# Altium project SingleChip-Rev2.PrjPcb (part 1 of 8)
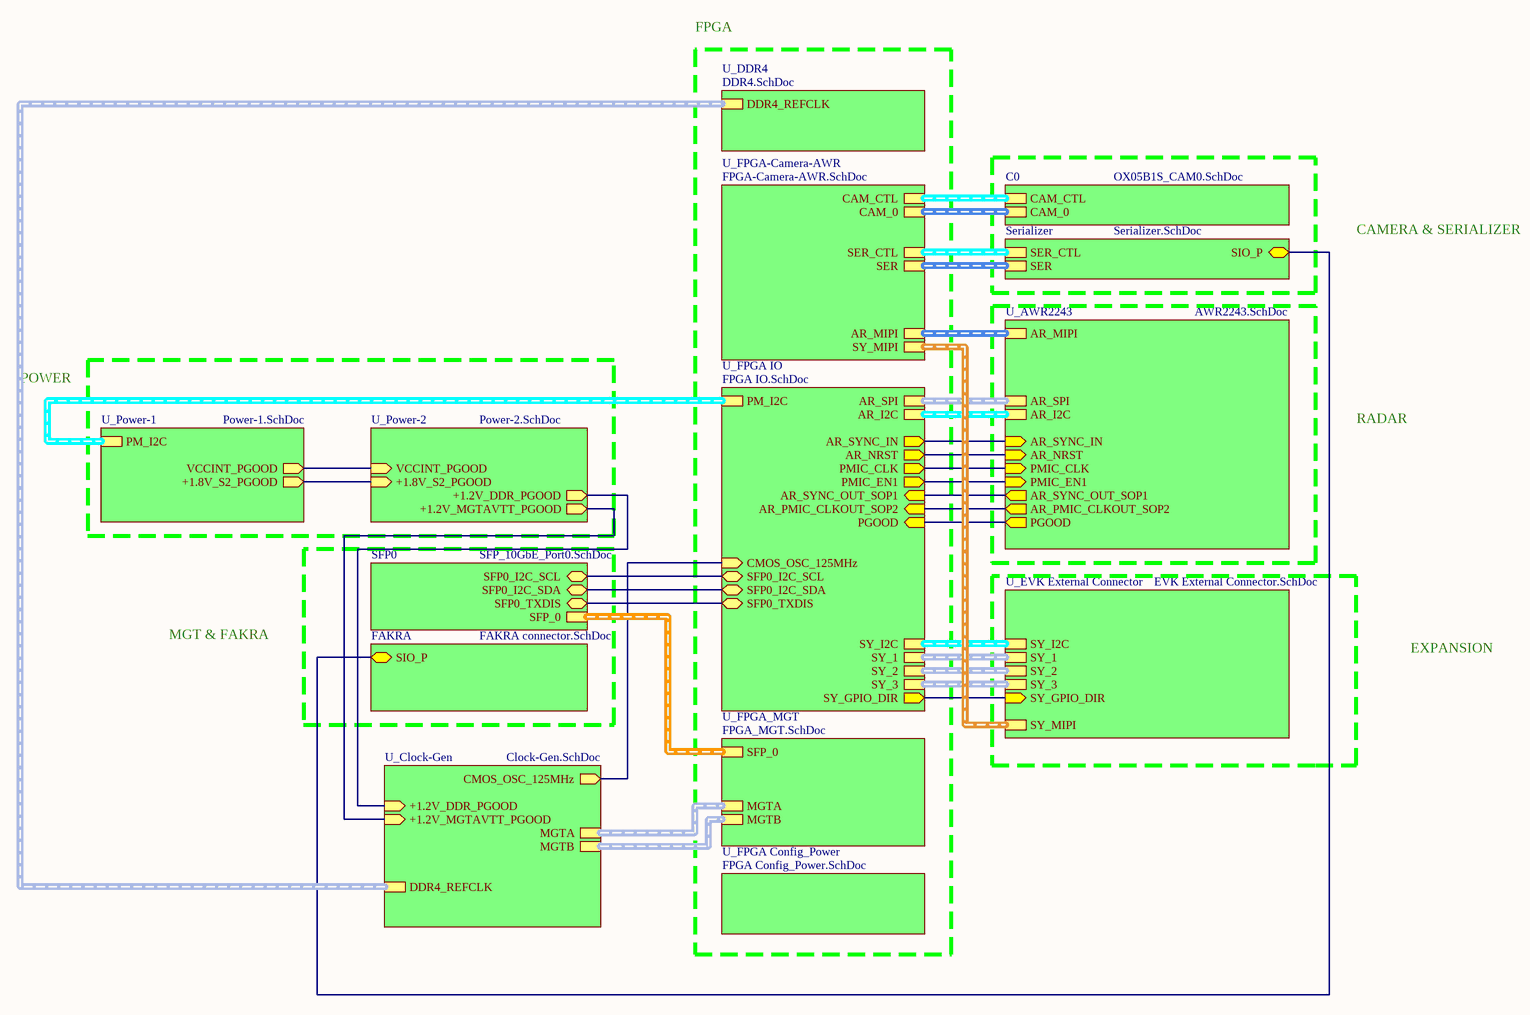
[diagram p0: SingleChipBlockDiagram.SchDoc]
docnumber: SCH-0001; ProjectTitle: Single Chip Radar (PN: BFI-2C1R); revnum: 2
20 sheets, 609 parts. Net scope: hierarchical (ports join the sheet entries above them; power ports are global).
Board file: Single Chip Radar.PcbDoc
Sheets:
  SingleChipBlockDiagram.SchDoc
    U_AWR2243 = AWR2243.SchDoc
      U_AWR2243_Decoupling_Caps = AWR2243_Decoupling_Caps.SchDoc
      U_AWR2243_DUT = AWR2243_DUT.SchDoc
      U_AWR2243_ExPWR_RST_LEDs = AWR2243_ExPWR_RST_LEDs.SchDoc
      U_AWR2243_LC_Filtering = AWR2243_LC_Filtering.SchDoc
      U_AWR2243_PMIC = AWR2243_PMIC.SchDoc
    U_DDR4 = DDR4.SchDoc
    U_FPGA-Camera-AWR = FPGA-Camera-AWR.SchDoc
    U_FPGA Config_Power = FPGA Config_Power.SchDoc
    U_FPGA IO = FPGA IO.SchDoc
    U_Power-1 = Power-1.SchDoc
    U_Power-2 = Power-2.SchDoc
    SFP0 = SFP_10GbE_Port0.SchDoc
    U_Clock-Gen = Clock-Gen.SchDoc
    C0 = OX05B1S_CAM0.SchDoc
    Serializer = Serializer.SchDoc
    U_FPGA_MGT = FPGA_MGT.SchDoc
    U_EVK External Connector = EVK External Connector.SchDoc
    FAKRA = FAKRA connector.SchDoc

## Sheet SingleChipBlockDiagram.SchDoc: =ProjectTitle
size A3; PageSetup: Record=PageOptions|CenterHorizontal=True|CenterVertical=True|PrintScale=1.00|XCorrection=1.00|YCorrection=1.00|PrintKind=0|BorderSize=5000000|LeftOffset=0|BottomOffset=0|Orientation=2|PaperLength=1000|PaperWidth=1000|Scale=100|PaperSource=15|PrintQuality=600|MediaType=1|DitherType=10|PaperKind=Letter|PrintScaleMode=1; Author: Jaime I. Chait; Organization: NWES LLC; Address1: 111 SW 5th Ave, STE 3150; Address2: Portland, OR 97204; DocumentNumber: SCH-0001; Revision: 2; SheetNumber: 1; SheetTotal: 19

### Sub-sheets
C0 = OX05B1S_CAM0.SchDoc: CAM_0 (harness MIPI), CAM_CTL (harness CAM_CTL)
FAKRA = FAKRA connector.SchDoc: SIO_P (bidir)
Serializer = Serializer.SchDoc: SER (harness MIPI), SER_CTL (harness SER_CTRL), SIO_P (bidir)
SFP0 = SFP_10GbE_Port0.SchDoc: SFP_0 (harness SFT_MGT), SFP0_I2C_SCL (bidir), SFP0_I2C_SDA (bidir), SFP0_TXDIS (bidir)
U_AWR2243 = AWR2243.SchDoc: PMIC_CLK (in), PMIC_EN1 (in), AR_SYNC_OUT_SOP1 (out), AR_PMIC_CLKOUT_SOP2 (out), AR_SPI (harness SPI), AR_MIPI (harness AR_MIPI), PGOOD (out), AR_SYNC_IN (in), AR_NRST (in), AR_I2C (harness I2C)
U_Clock-Gen = Clock-Gen.SchDoc: CMOS_OSC_125MHz (out), +1.2V_MGTAVTT_PGOOD (in), MGTA (harness DIFF_CLK), MGTB (harness DIFF_CLK), DDR4_REFCLK (harness DIFF_CLK), +1.2V_DDR_PGOOD (in)
U_DDR4 = DDR4.SchDoc: DDR4_REFCLK (harness DIFF_CLK)
U_EVK External Connector = EVK External Connector.SchDoc: SY_MIPI (harness SY_MIPI), SY_I2C (harness I2C), SY_1 (harness GPIO group), SY_2 (harness GPIO group), SY_3 (harness GPIO group), SY_GPIO_DIR (in)
U_FPGA Config_Power = FPGA Config_Power.SchDoc: no entries
U_FPGA IO = FPGA IO.SchDoc: CMOS_OSC_125MHz (in), AR_NRST (out), PGOOD (in), PMIC_CLK (out), PMIC_EN1 (out), AR_SYNC_IN (out), AR_SPI (harness SPI), SY_I2C (harness I2C), AR_I2C (harness I2C), AR_PMIC_CLKOUT_SOP2 (in), AR_SYNC_OUT_SOP1 (in), PM_I2C (harness I2C), SFP0_I2C_SCL (bidir), SFP0_I2C_SDA (bidir), SFP0_TXDIS (bidir), SY_1 (harness GPIO group), SY_2 (harness GPIO group), SY_3 (harness GPIO group), SY_GPIO_DIR (out)
U_FPGA-Camera-AWR = FPGA-Camera-AWR.SchDoc: AR_MIPI (harness AR_MIPI), CAM_0 (harness MIPI), CAM_CTL (harness CAM_CTL), SY_MIPI (harness SY_MIPI), SER (harness MIPI), SER_CTL (harness SER_CTRL)
U_FPGA_MGT = FPGA_MGT.SchDoc: MGTA (harness DIFF_CLK), MGTB (harness DIFF_CLK), SFP_0 (harness SFT_MGT)
U_Power-1 = Power-1.SchDoc: +1.8V_S2_PGOOD (out), VCCINT_PGOOD (out), PM_I2C (harness I2C)
U_Power-2 = Power-2.SchDoc: VCCINT_PGOOD (in), +1.2V_MGTAVTT_PGOOD (out), +1.8V_S2_PGOOD (in), +1.2V_DDR_PGOOD (out)

### Nets
+1.2V_DDR_PGOOD: sheet U_Power-2/+1.2V_DDR_PGOOD, sheet U_Clock-Gen/+1.2V_DDR_PGOOD
+1.2V_MGTAVTT_PGOOD: sheet U_Power-2/+1.2V_MGTAVTT_PGOOD, sheet U_Clock-Gen/+1.2V_MGTAVTT_PGOOD
+1.8V_S2_PGOOD: sheet U_Power-1/+1.8V_S2_PGOOD, sheet U_Power-2/+1.8V_S2_PGOOD
AR_NRST: sheet U_AWR2243/AR_NRST, sheet U_FPGA IO/AR_NRST
AR_PMIC_CLKOUT_SOP2: sheet U_AWR2243/AR_PMIC_CLKOUT_SOP2, sheet U_FPGA IO/AR_PMIC_CLKOUT_SOP2
AR_SYNC_IN: sheet U_AWR2243/AR_SYNC_IN, sheet U_FPGA IO/AR_SYNC_IN
AR_SYNC_OUT_SOP1: sheet U_AWR2243/AR_SYNC_OUT_SOP1, sheet U_FPGA IO/AR_SYNC_OUT_SOP1
CMOS_OSC_125MHz: sheet U_FPGA IO/CMOS_OSC_125MHz, sheet U_Clock-Gen/CMOS_OSC_125MHz
PGOOD: sheet U_AWR2243/PGOOD, sheet U_FPGA IO/PGOOD
PMIC_CLK: sheet U_AWR2243/PMIC_CLK, sheet U_FPGA IO/PMIC_CLK
PMIC_EN1: sheet U_AWR2243/PMIC_EN1, sheet U_FPGA IO/PMIC_EN1
SFP_CTRL0_I2C_SCL: sheet U_FPGA IO/SFP0_I2C_SCL, sheet SFP0/SFP0_I2C_SCL
SFP_CTRL0_I2C_SDA: sheet U_FPGA IO/SFP0_I2C_SDA, sheet SFP0/SFP0_I2C_SDA
SFP_CTRL0_TX_DISABLE: sheet U_FPGA IO/SFP0_TXDIS, sheet SFP0/SFP0_TXDIS
SY_GPIO_DIR: sheet U_FPGA IO/SY_GPIO_DIR, sheet U_EVK External Connector/SY_GPIO_DIR
VCCINT_PGOOD: sheet U_Power-1/VCCINT_PGOOD, sheet U_Power-2/VCCINT_PGOOD
NetC188_1: sheet Serializer/SIO_P, sheet FAKRA/SIO_P

### Buses and harness runs
harness sheet C0/CAM_0 = sheet U_FPGA-Camera-AWR/CAM_0
harness sheet C0/CAM_CTL = sheet U_FPGA-Camera-AWR/CAM_CTL
harness sheet Serializer/SER = sheet U_FPGA-Camera-AWR/SER
harness sheet Serializer/SER_CTL = sheet U_FPGA-Camera-AWR/SER_CTL
harness sheet SFP0/SFP_0 = sheet U_FPGA_MGT/SFP_0
harness sheet U_AWR2243/AR_I2C = sheet U_FPGA IO/AR_I2C
harness sheet U_AWR2243/AR_MIPI = sheet U_FPGA-Camera-AWR/AR_MIPI
harness sheet U_AWR2243/AR_SPI = sheet U_FPGA IO/AR_SPI
harness sheet U_Clock-Gen/DDR4_REFCLK = sheet U_DDR4/DDR4_REFCLK
harness sheet U_Clock-Gen/MGTA = sheet U_FPGA_MGT/MGTA
harness sheet U_Clock-Gen/MGTB = sheet U_FPGA_MGT/MGTB
harness sheet U_EVK External Connector/SY_1 = sheet U_FPGA IO/SY_1
harness sheet U_EVK External Connector/SY_2 = sheet U_FPGA IO/SY_2
harness sheet U_EVK External Connector/SY_3 = sheet U_FPGA IO/SY_3
harness sheet U_EVK External Connector/SY_I2C = sheet U_FPGA IO/SY_I2C
harness sheet U_EVK External Connector/SY_MIPI = sheet U_FPGA-Camera-AWR/SY_MIPI
harness sheet U_FPGA IO/PM_I2C = sheet U_Power-1/PM_I2C

### Notes on the sheet
- FPGA
- CAMERA & SERIALIZER
- POWER
- RADAR
- MGT & FAKRA
- EXPANSION
- Title
- Size:
- Date:
- A4
- Number:
- Time:
- Revision:
- Sheet
- of
- File:

## Sheet AWR2243.SchDoc: =ProjectTitle
size A3; PageSetup: Record=PageOptions|CenterHorizontal=True|CenterVertical=True|PrintScale=1.00|XCorrection=1.00|YCorrection=1.00|PrintKind=0|BorderSize=5000000|LeftOffset=0|BottomOffset=0|Orientation=2|PaperLength=1000|PaperWidth=1000|Scale=100|PaperSource=15|PrintQuality=600|MediaType=1|DitherType=10|PaperKind=Letter|PrintScaleMode=1; Author: Jaime I. Chait; Organization: NWES LLC; Address1: 111 SW 5th Ave, STE 3150; Address2: Portland, OR 97204; DocumentNumber: SCH-0001; Revision: 2; SheetNumber: 4; SheetTotal: 19
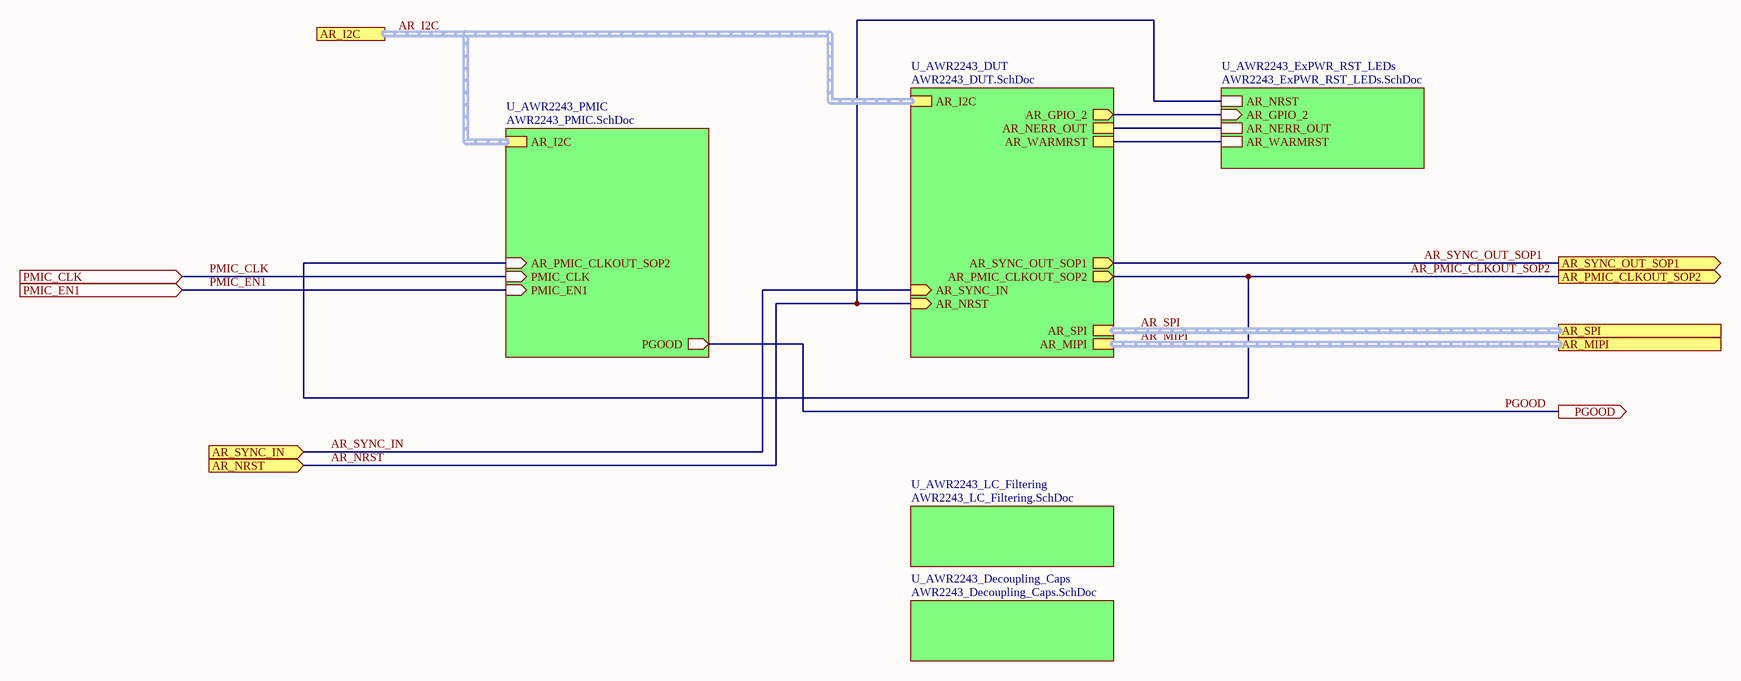
[diagram p1: AWR2243.SchDoc]

### Sub-sheets
U_AWR2243_Decoupling_Caps = AWR2243_Decoupling_Caps.SchDoc: no entries
U_AWR2243_DUT = AWR2243_DUT.SchDoc: AR_SYNC_IN (in), AR_MIPI (harness AR_MIPI), AR_SPI (harness SPI), AR_GPIO_2 (out), AR_PMIC_CLKOUT_SOP2 (out), AR_NRST (in), AR_SYNC_OUT_SOP1 (out), AR_NERR_OUT, AR_WARMRST, AR_I2C (harness I2C)
U_AWR2243_ExPWR_RST_LEDs = AWR2243_ExPWR_RST_LEDs.SchDoc: AR_NRST, AR_GPIO_2 (in), AR_NERR_OUT, AR_WARMRST
U_AWR2243_LC_Filtering = AWR2243_LC_Filtering.SchDoc: no entries
U_AWR2243_PMIC = AWR2243_PMIC.SchDoc: PMIC_CLK (in), PMIC_EN1 (in), PGOOD (out), AR_PMIC_CLKOUT_SOP2 (in), AR_I2C (harness I2C)

### Ports
AR_I2C (harness I2C), AR_MIPI (harness AR_MIPI), AR_NRST (in), AR_PMIC_CLKOUT_SOP2 (out), AR_SPI (harness SPI), AR_SYNC_IN (in), AR_SYNC_OUT_SOP1 (out), PGOOD (out), PMIC_CLK (in), PMIC_EN1 (in)

### Nets
AR_GPIO_2: sheet U_AWR2243_DUT/AR_GPIO_2, sheet U_AWR2243_ExPWR_RST_LEDs/AR_GPIO_2
AR_NERR_OUT: sheet U_AWR2243_DUT/AR_NERR_OUT, sheet U_AWR2243_ExPWR_RST_LEDs/AR_NERR_OUT
AR_NRST: port AR_NRST, sheet U_AWR2243_DUT/AR_NRST, sheet U_AWR2243_ExPWR_RST_LEDs/AR_NRST
AR_PMIC_CLKOUT_SOP2: port AR_PMIC_CLKOUT_SOP2, sheet U_AWR2243_DUT/AR_PMIC_CLKOUT_SOP2, sheet U_AWR2243_PMIC/AR_PMIC_CLKOUT_SOP2
AR_SYNC_IN: port AR_SYNC_IN, sheet U_AWR2243_DUT/AR_SYNC_IN
AR_SYNC_OUT_SOP1: port AR_SYNC_OUT_SOP1, sheet U_AWR2243_DUT/AR_SYNC_OUT_SOP1
AR_WARMRST: sheet U_AWR2243_DUT/AR_WARMRST, sheet U_AWR2243_ExPWR_RST_LEDs/AR_WARMRST
PGOOD: port PGOOD, sheet U_AWR2243_PMIC/PGOOD
PMIC_CLK: port PMIC_CLK, sheet U_AWR2243_PMIC/PMIC_CLK
PMIC_EN1: port PMIC_EN1, sheet U_AWR2243_PMIC/PMIC_EN1

### Buses and harness runs
harness AR_I2C = port AR_I2C = sheet U_AWR2243_DUT/AR_I2C = sheet U_AWR2243_PMIC/AR_I2C
harness AR_MIPI = port AR_MIPI = sheet U_AWR2243_DUT/AR_MIPI
harness AR_SPI = port AR_SPI = sheet U_AWR2243_DUT/AR_SPI

### Notes on the sheet
- Title
- Size:
- Date:
- A4
- Number:
- Time:
- Revision:
- Sheet
- of
- File:

## Sheet AWR2243_Decoupling_Caps.SchDoc: =ProjectTitle
size A3; PageSetup: Record=PageOptions|CenterHorizontal=True|CenterVertical=True|PrintScale=1.00|XCorrection=1.00|YCorrection=1.00|PrintKind=0|BorderSize=5000000|LeftOffset=0|BottomOffset=0|Orientation=2|PaperLength=1000|PaperWidth=1000|Scale=100|PaperSource=15|PrintQuality=600|MediaType=1|DitherType=10|PaperKind=Letter|PrintScaleMode=1; Author: Jaime I. Chait; Organization: NWES LLC; Address1: 111 SW 5th Ave, STE 3150; Address2: Portland, OR 97204; DocumentNumber: SCH-0001; Revision: 2; SheetNumber: 5; SheetTotal: 19
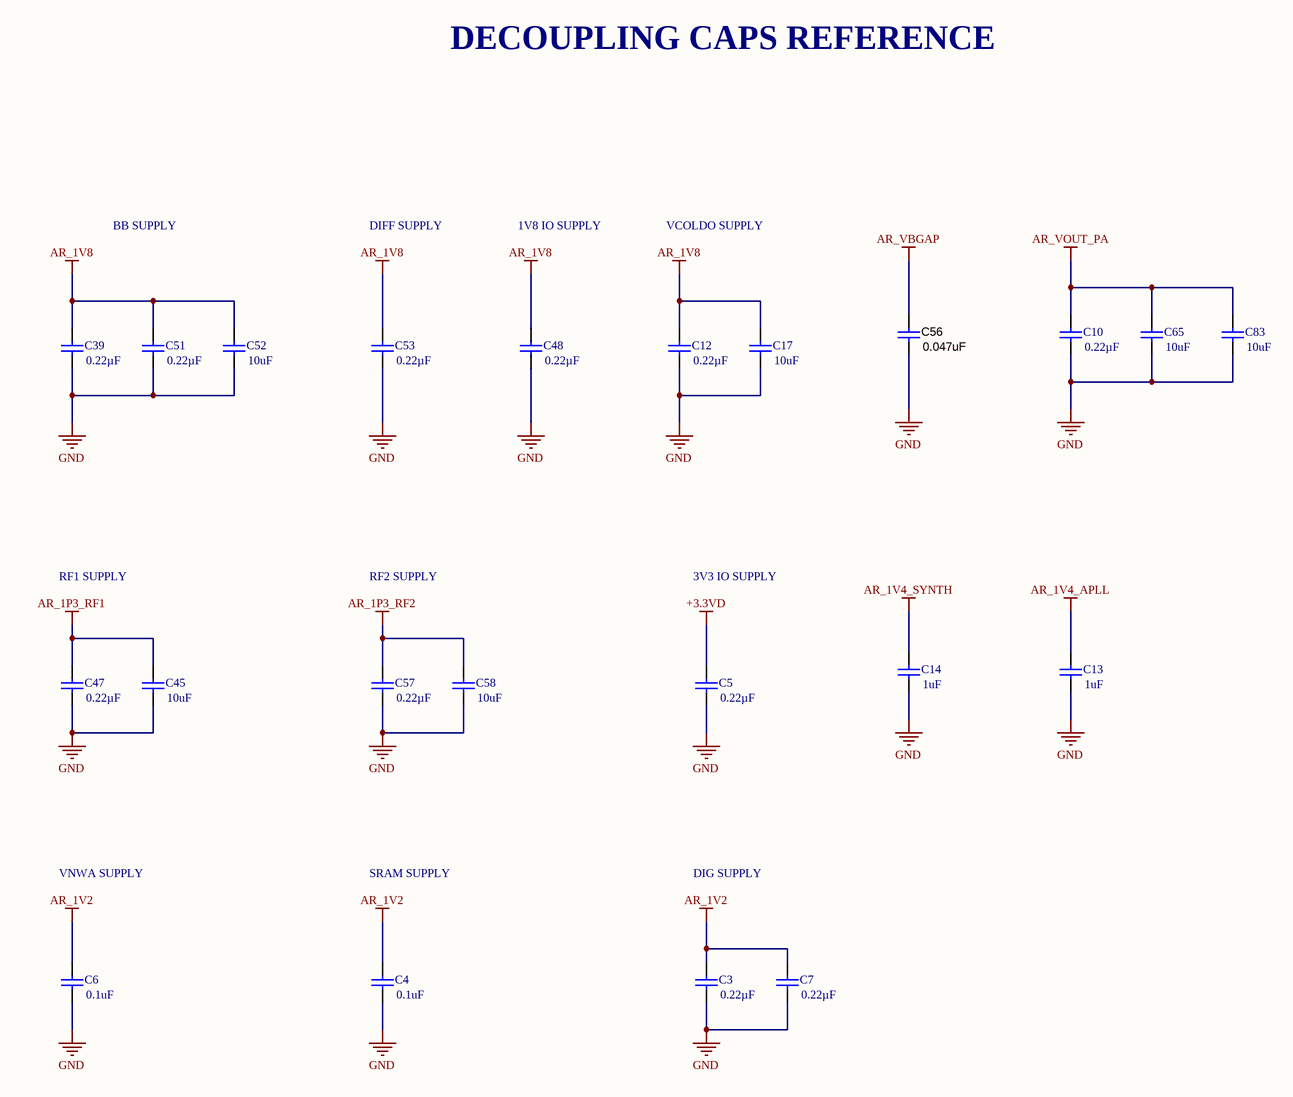
[diagram p2: AWR2243_Decoupling_Caps.SchDoc]

### Parts
C3  ValueDisplayed: 0.22µF  [0402L]  (hidden comment: GCM155R71C224KE02D)
C4  ValueDisplayed: 0.1uF  [0402L]  (hidden comment: GCM155R71C104KA55D)
C5  ValueDisplayed: 0.22µF  [0402L]  (hidden comment: GCM155R71C224KE02D)
C6  ValueDisplayed: 0.1uF  [0402]  (hidden comment: GCM155R71C104KA55D)
C7  ValueDisplayed: 0.22µF  [0402L]  (hidden comment: GCM155R71C224KE02D)
C10  ValueDisplayed: 0.22µF  [0402]  (hidden comment: GCM155R71C224KE02D)
C12  ValueDisplayed: 0.22µF  [0402]  (hidden comment: GCM155R71C224KE02D)
C13  ValueDisplayed: 1uF  [0603]  (hidden comment: GCM188R71C105KA64D)
C14  ValueDisplayed: 1uF  [0603]  (hidden comment: GCM188R71C105KA64D)
C17  ValueDisplayed: 10uF  [0805_HV]  (hidden comment: GCM21BR71A106KE22L)
C39  ValueDisplayed: 0.22µF  [0402L]  (hidden comment: GCM155R71C224KE02D)
C45  ValueDisplayed: 10uF  [0805_HV1]  (hidden comment: GCM21BR71A106KE22L)
C47  ValueDisplayed: 0.22µF  [0402L]  (hidden comment: GCM155R71C224KE02D)
C48  ValueDisplayed: 0.22µF  [0402]  (hidden comment: GCM155R71C224KE02D)
C51  ValueDisplayed: 0.22µF  [0402]  (hidden comment: GCM155R71C224KE02D)
C52  ValueDisplayed: 10uF  [0805_HV]  (hidden comment: GCM21BR71A106KE22L)
C53  ValueDisplayed: 0.22µF  [0402]  (hidden comment: GCM155R71C224KE02D)
C56  ValueDisplayed: 0.047uF  [0402]  (hidden comment: CGA2B3X7R1H473K050BB)
C57  ValueDisplayed: 0.22µF  [0402]  (hidden comment: GCM155R71C224KE02D)
C58  ValueDisplayed: 10uF  [0805]  (hidden comment: GCM21BR71A106KE22L)
C65  ValueDisplayed: 10uF  [0805_HV]  (hidden comment: GCM21BR71A106KE22L)
C83  ValueDisplayed: 10uF  [0805_HV]  (hidden comment: GCM21BR71A106KE22L)

### Nets
+3.3VD: C5.1
AR_1P3_RF1: C45.1 C47.1
AR_1P3_RF2: C57.1 C58.1
AR_1V2: C3.1 C4.1 C6.1 C7.1
AR_1V4_APLL: C13.1
AR_1V4_SYNTH: C14.1
AR_1V8: C12.1 C17.1 C39.1 C48.1 C51.1 C52.1 C53.1
AR_VBGAP: C56.1
AR_VOUT_PA: C10.1 C65.1 C83.1
GND: C3.2 C4.2 C5.2 C6.2 C7.2 C10.2 C12.2 C13.2 C14.2 C17.2 C39.2 C45.2 C47.2 C48.2 C51.2 C52.2 C53.2 C56.2 C57.2 C58.2 C65.2 C83.2

### Notes on the sheet
- DECOUPLING CAPS REFERENCE
- BB SUPPLY
- DIFF SUPPLY
- 1V8 IO SUPPLY
- VCOLDO SUPPLY
- RF1 SUPPLY
- RF2 SUPPLY
- 3V3 IO SUPPLY
- VNWA SUPPLY
- SRAM SUPPLY
- DIG SUPPLY
- Title
- Size:
- Date:
- A4
- Number:
- Time:
- Revision:
- Sheet
- of
- File:

### Library data of the parts
C3 C5 C7 C39 C47 = CMP-0078265-1: CAP, CERM, 0.22 µF, 16 V,+/- 10%, X7R, AEC-Q200 Grade 1, 0402; Manufacturer: MuRata; TaMin_C: -55°C; Polarized: N; SizeAreaWB_mm2: 3; U/M: EA; Value: 0.22uF; TaMax_C: 125°C; SizeZ_mm: 0.6; SizeX_mm: 1; SizeY_mm: 0.5; Cap_Case: 0402; Value2: 16V; CompType: Capacitor; AEC Qualified: Y; Cap_F: 220nF; AEC Category: Q200; ComponentLink1URL: http://psearch.en.murata.com/capacitor/product/GCM155R71C224KE02%23.pdf; Supplier Part Number 2: 81-GCM155R71C224KE2D; Supplier 2: Mouser; TempCo: X7R; RoHS: Y; MountType: SMT; Supplier 1: Digi-Key; PackageReference: 0402; Tolerance_%: 10%; SizeArea_mm2: 0.5; PartNumber: GCM155R71C224KE02D; VDC_V: 16V; ComponentLink1Description: Datasheet link; AEC Grade: 1; Supplier Part Number 1: 490-10671-1-ND; Technology: Ceramic
C4 = CMP-0006351-2: CAP, CERM, 0.1 uF, 16 V, +/- 10%, X7R, 0402; Manufacturer: MuRata; TaMin_C: -55°C; Polarized: N; SizeAreaWB_mm2: 3; Value1: Unknown; U/M: EA; Value: 0.1uF; TaMax_C: 125°C; SizeZ_mm: 0.6; SizeX_mm: 1; SizeY_mm: 0.5; Cap_Case: 0402; Value2: 16V; CompType: Capacitor; Cap_F: 100nF; AEC Category: Q200; Publisher: Texas Instruments; TempCo: X7R; Published: 2008-06-19; RoHS: Y; MountType: SMT; Supplier 1: Digi-Key; PackageReference: 0402; Tolerance_%: 10%; SizeArea_mm2: 0.5; LatestRevisionDate: 2017-03-09; PartNumber: GCM155R71C104KA55D; AEC Qualified: ?; VDC_V: 16V; ComponentLink1Description: Datasheet link; Supplier Part Number 1: 490-4759-2-ND; Technology: Ceramic; ComponentLink1URL: http://psearch.murata.com/capacitor/product/GCM155R71C104KA55%23.pdf
C6 = CMP-0006351-2: CAP, CERM, 0.1 uF, 16 V, +/- 10%, X7R, 0402; Manufacturer: MuRata; TaMin_C: -55°C; Polarized: N; SizeAreaWB_mm2: 3; Value1: Unknown; U/M: EA; Value: 0.1uF; TaMax_C: 125°C; SizeZ_mm: 0.6; SizeX_mm: 1; SizeY_mm: 0.5; Value2: 16V; Cap_F: 100nF; AEC Category: Q200; Publisher: Texas Instruments; TempCo: X7R; Published: 2008-06-19; RoHS: Y; MountType: SMT; Supplier 1: Digi-Key; PackageReference: 0402; Tolerance_%: 10%; Cap_Case: 0402; SizeArea_mm2: 0.5; CompType: Capacitor; LatestRevisionDate: 2017-03-09; PartNumber: GCM155R71C104KA55D; AEC Qualified: ?; VDC_V: 16V; ComponentLink1Description: Datasheet link; Supplier Part Number 1: 490-4759-2-ND; Technology: Ceramic; ComponentLink1URL: http://psearch.murata.com/capacitor/product/GCM155R71C104KA55%23.pdf
C10 C12 C48 C51 C53 C57 = CMP-0078265-1: CAP, CERM, 0.22 µF, 16 V,+/- 10%, X7R, AEC-Q200 Grade 1, 0402; Manufacturer: MuRata; TaMin_C: -55°C; Polarized: N; SizeAreaWB_mm2: 3; U/M: EA; Value: 0.22uF; TaMax_C: 125°C; SizeZ_mm: 0.6; SizeX_mm: 1; SizeY_mm: 0.5; Value2: 16V; AEC Qualified: Y; Cap_F: 220nF; AEC Category: Q200; ComponentLink1URL: http://psearch.en.murata.com/capacitor/product/GCM155R71C224KE02%23.pdf; Supplier Part Number 2: 81-GCM155R71C224KE2D; Supplier 2: Mouser; TempCo: X7R; RoHS: Y; MountType: SMT; Supplier 1: Digi-Key; PackageReference: 0402; Tolerance_%: 10%; Cap_Case: 0402; SizeArea_mm2: 0.5; CompType: Capacitor; PartNumber: GCM155R71C224KE02D; VDC_V: 16V; ComponentLink1Description: Datasheet link; AEC Grade: 1; Supplier Part Number 1: 490-10671-1-ND; Technology: Ceramic
C13 C14 = CMP-0007136-5: CAP, CERM, 1 uF, 16 V, +/- 10%, X7R, AEC-Q200 Grade 1, 0603; Manufacturer: MuRata; TaMin_C: -55°C; Polarized: N; SizeAreaWB_mm2: 4.68; Value1: Unknown; U/M: EA; Value: 1uF; TaMax_C: 125°C; SizeZ_mm: 1; SizeX_mm: 1.6; SizeY_mm: 0.8; Value2: 16V; SizeArea_mm2: 1.28; AEC Qualified: Y; Cap_F: 1µF; AEC Category: Q200; Supplier Part Number 2: 81-GCM188R71C105K64D; Publisher: Texas Instruments; Supplier 2: Mouser; TempCo: X7R; Published: 2008-06-19; RoHS: Y; MountType: SMT; Supplier 1: Digi-Key; PackageReference: 0603; Tolerance_%: 10%; Cap_Case: 0603; CompType: Capacitor; LatestRevisionDate: 2017-03-09; PartNumber: GCM188R71C105KA64D; VDC_V: 16V; ComponentLink1Description: Datasheet link; AEC Grade: 1; Supplier Part Number 1: 490-5241-6-ND; Technology: Ceramic; ComponentLink1URL: http://psearch.en.murata.com/capacitor/product/GCM188R71C105KA64%23.pdf
C17 C52 C65 C83 = CMP-0008017-2: CAP, CERM, 10 uF, 10 V, +/- 10%, X7R, 0805; Manufacturer: MuRata; TaMin_C: -55°C; Polarized: N; SizeAreaWB_mm2: 6.75; Value1: Unknown; U/M: EA; Value: 10uF; TaMax_C: 125°C; SizeZ_mm: 1.45; SizeX_mm: 2; SizeY_mm: 1.25; Cap_Case: 0805; Value2: 10V; SizeArea_mm2: 2.5; Cap_F: 10µF; AEC Category: Q200; Supplier Part Number 2: 06AC6014; Publisher: Texas Instruments; Supplier 2: Newark; Supplier Part Number 3: 81-GCM21BR71A106KE2L; TempCo: X7R; Supplier 3: Mouser; Published: 2008-06-19; RoHS: Y; MountType: SMT; Supplier 1: Digi-Key; PackageReference: 0805; Tolerance_%: 10%; CompType: Capacitor; LatestRevisionDate: 2017-03-09; PartNumber: GCM21BR71A106KE22L; AEC Qualified: ?; VDC_V: 10V; ComponentLink1Description: Datasheet link; Supplier Part Number 1: 490-10674-1-ND; Technology: Ceramic; ComponentLink1URL: http://www.murata.com/products/catalog/pdf/c03e.pdf
C45 = CMP-0008017-2: CAP, CERM, 10 uF, 10 V, +/- 10%, X7R, 0805; Manufacturer: MuRata; TaMin_C: -55°C; Polarized: N; SizeAreaWB_mm2: 6.75; Value1: Unknown; U/M: EA; Value: 10uF; TaMax_C: 125°C; SizeZ_mm: 1.45; SizeX_mm: 2; SizeY_mm: 1.25; Cap_Case: 0805; Value2: 10V; SizeArea_mm2: 2.5; CompType: Capacitor; Cap_F: 10µF; AEC Category: Q200; Supplier Part Number 2: 06AC6014; Publisher: Texas Instruments; Supplier 2: Newark; Supplier Part Number 3: 81-GCM21BR71A106KE2L; TempCo: X7R; Supplier 3: Mouser; Published: 2008-06-19; RoHS: Y; MountType: SMT; Supplier 1: Digi-Key; PackageReference: 0805; Tolerance_%: 10%; LatestRevisionDate: 2017-03-09; PartNumber: GCM21BR71A106KE22L; AEC Qualified: ?; VDC_V: 10V; ComponentLink1Description: Datasheet link; Supplier Part Number 1: 490-10674-1-ND; Technology: Ceramic; ComponentLink1URL: http://www.murata.com/products/catalog/pdf/c03e.pdf
C56 = CMP-0006330-2: CAP, CERM, 0.047 uF, 50 V, +/- 10%, X7R, AEC-Q200 Grade 1, 0402; Manufacturer: TDK; TaMin_C: -55°C; ESR_ohm: 0.06407; Polarized: N; SizeAreaWB_mm2: 3; Value1: 0.06407 ohm; U/M: EA; TaMax_C: 125°C; SizeZ_mm: 0.6; SizeX_mm: 1; SizeY_mm: 0.5; Value2: 50V; AEC Qualified: Y; Cap_F: 47nF; IRMS_A: 646.122mA; AEC Category: Q200; Supplier Part Number 2: 810-CGA2B3X7R1H473K050BB; Publisher: Texas Instruments; Supplier 2: Mouser; TempCo: X7R; Published: 2008-06-19; RoHS: Y; MountType: SMT; Value: 0.047uF; Supplier 1: Digi-Key; PackageReference: 0402; Tolerance_%: 10%; Cap_Case: 0402; SizeArea_mm2: 0.5; CompType: Capacitor; LatestRevisionDate: 2017-03-09; PartNumber: CGA2B3X7R1H473K050BB; VDC_V: 50V; ComponentLink1Description: Datasheet link; AEC Grade: 1; Supplier Part Number 1: 445-6897-1-ND; Technology: Ceramic; ComponentLink1URL: https://product.tdk.com/en/search/capacitor/ceramic/mlcc/info?part_no=CGA2B3X7R1H473K050BB
C58 = CMP-0008017-2: CAP, CERM, 10 uF, 10 V, +/- 10%, X7R, 0805; Manufacturer: MuRata; TaMin_C: -55°C; Polarized: N; SizeAreaWB_mm2: 6.75; Value1: Unknown; U/M: EA; Value: 10uF; TaMax_C: 125°C; SizeZ_mm: 1.45; SizeX_mm: 2; SizeY_mm: 1.25; Value2: 10V; SizeArea_mm2: 2.5; CompType: Capacitor; Cap_F: 10µF; AEC Category: Q200; Supplier Part Number 2: 06AC6014; Publisher: Texas Instruments; Supplier 2: Newark; Supplier Part Number 3: 81-GCM21BR71A106KE2L; TempCo: X7R; Supplier 3: Mouser; Published: 2008-06-19; RoHS: Y; MountType: SMT; Supplier 1: Digi-Key; PackageReference: 0805; Tolerance_%: 10%; Cap_Case: 0805; LatestRevisionDate: 2017-03-09; PartNumber: GCM21BR71A106KE22L; AEC Qualified: ?; VDC_V: 10V; ComponentLink1Description: Datasheet link; Supplier Part Number 1: 490-10674-1-ND; Technology: Ceramic; ComponentLink1URL: http://www.murata.com/products/catalog/pdf/c03e.pdf

## Sheet AWR2243_DUT.SchDoc: =ProjectTitle
size A3; PageSetup: Record=PageOptions|CenterHorizontal=True|CenterVertical=True|PrintScale=1.00|XCorrection=1.00|YCorrection=1.00|PrintKind=0|BorderSize=5000000|LeftOffset=0|BottomOffset=0|Orientation=2|PaperLength=1000|PaperWidth=1000|Scale=100|PaperSource=15|PrintQuality=600|MediaType=1|DitherType=10|PaperKind=Letter|PrintScaleMode=1; Author: Jaime I. Chait; Organization: NWES LLC; Address1: 111 SW 5th Ave, STE 3150; Address2: Portland, OR 97204; DocumentNumber: SCH-0001; Revision: 2; SheetNumber: 6; SheetTotal: 19
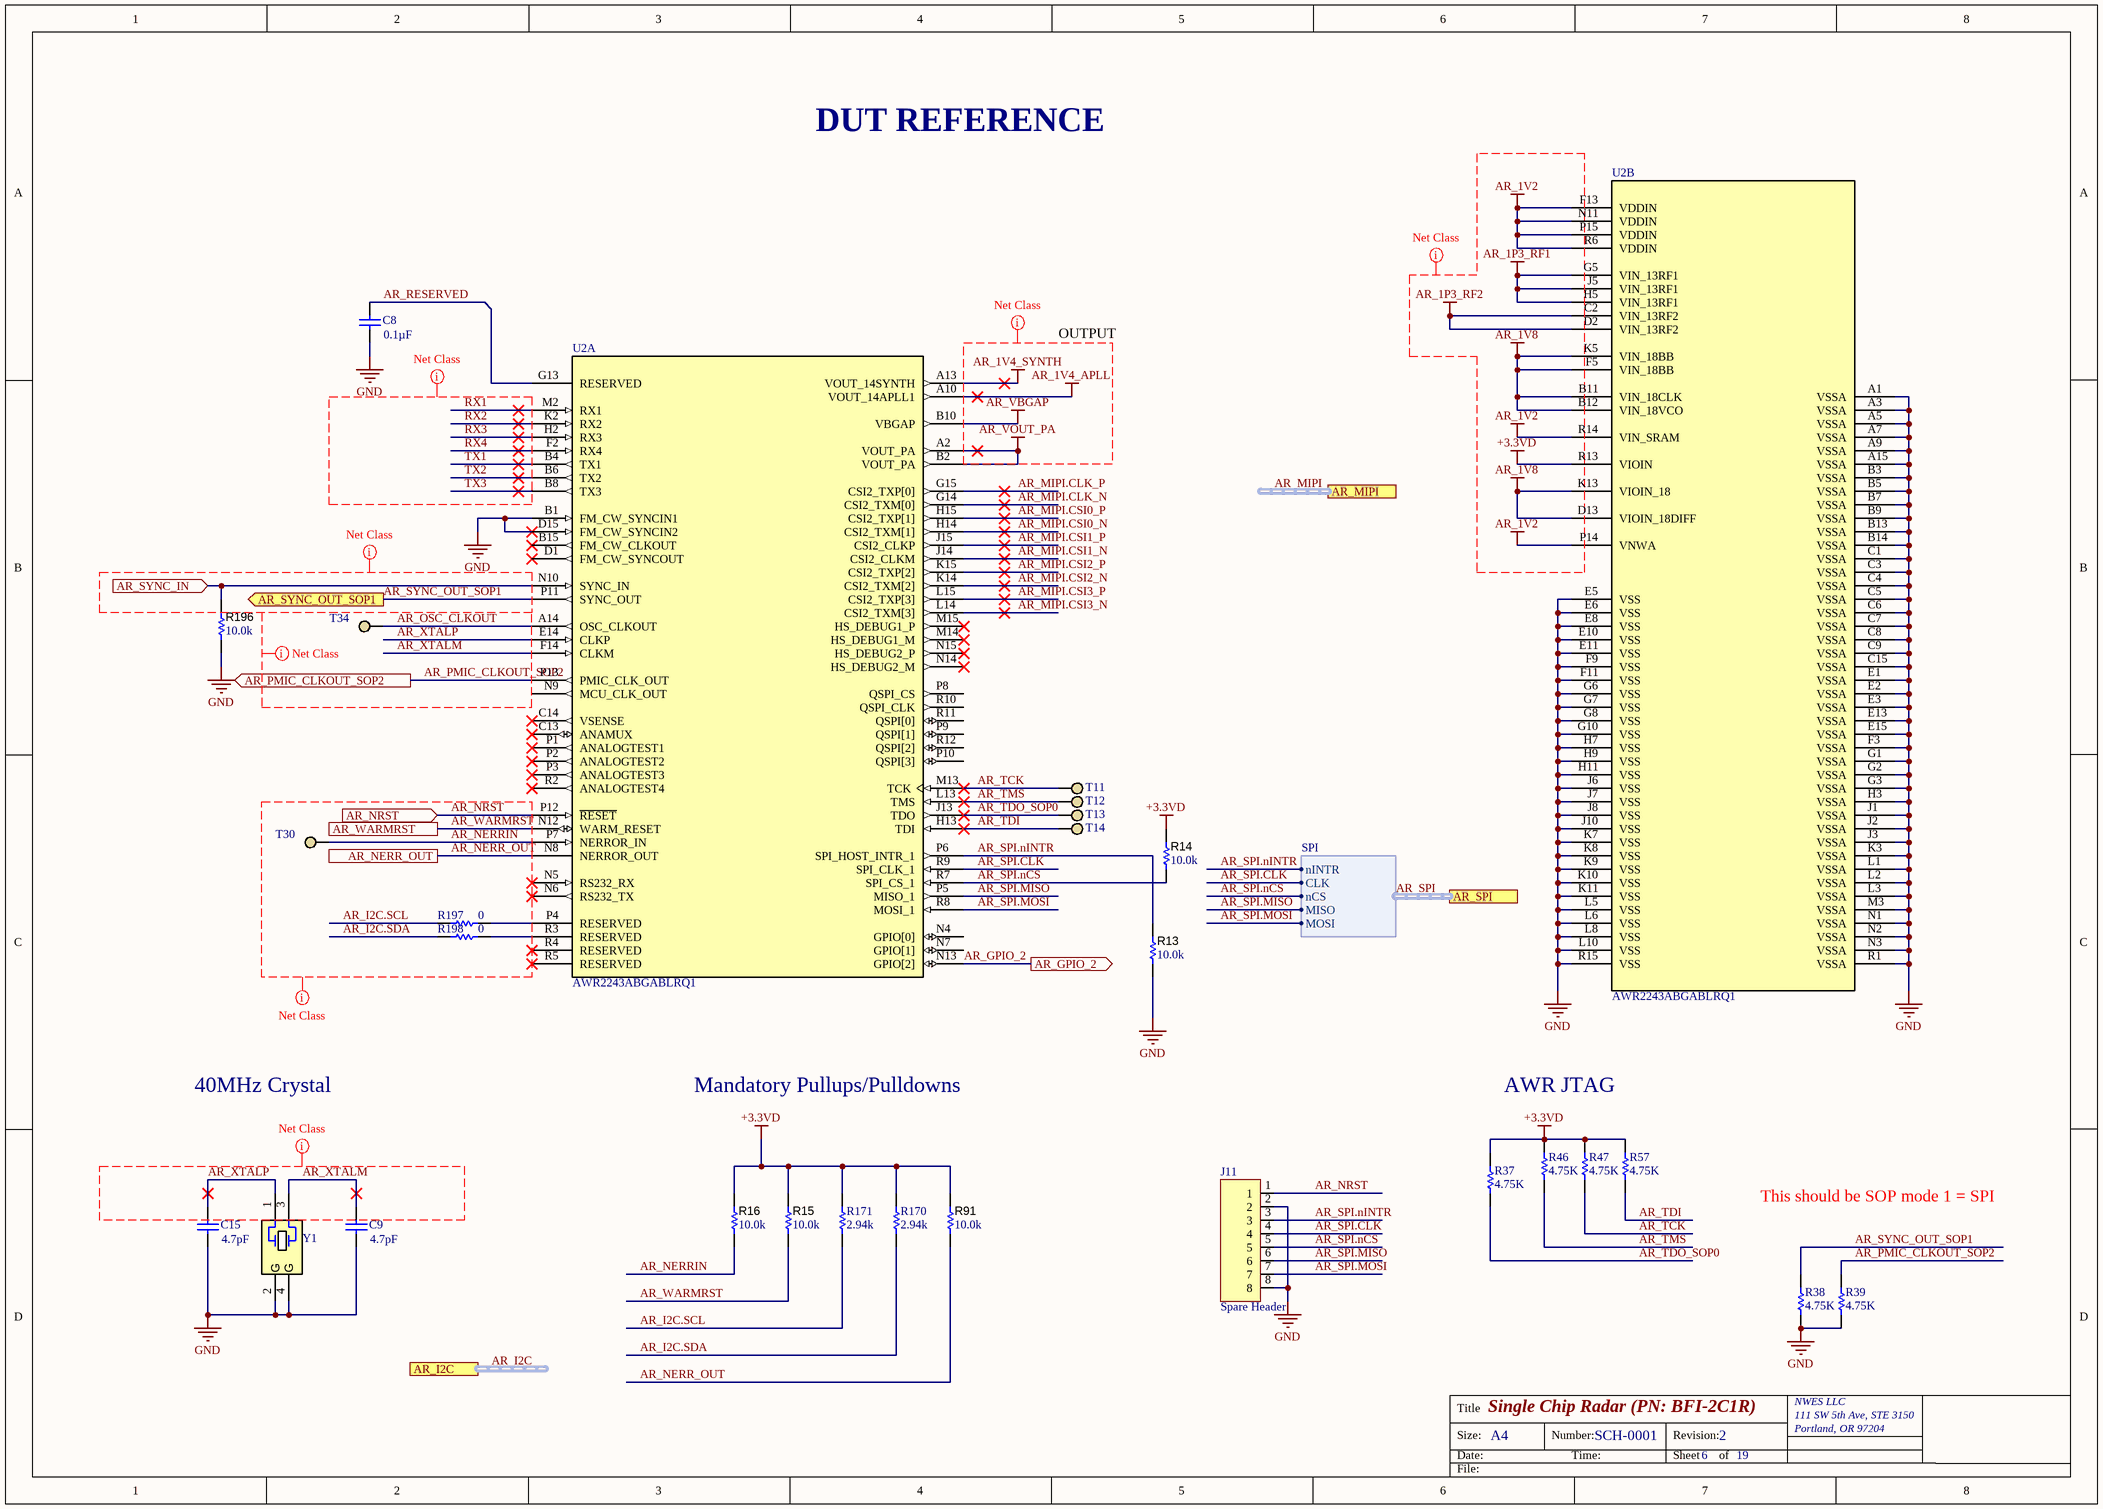
[diagram p3: AWR2243_DUT.SchDoc]

### Parts
C8  ValueDisplayed: 0.1µF  [0201_033]  (hidden comment: C0603X7S1A104K030BC)
C9  ValueDisplayed: 4.7pF  [0402]  (hidden comment: GJM1555C1H4R7BB01D)
C15  ValueDisplayed: 4.7pF  [0402]  (hidden comment: GJM1555C1H4R7BB01D)
J11  Spare Header  [HDR8X1_2.54MM]
R13  ValueDisplayed: 10.0k  [0402L]  (hidden comment: CRCW040210K0FKED)
R14  ValueDisplayed: 10.0k  [0402L]  (hidden comment: CRCW040210K0FKED)
R15  ValueDisplayed: 10.0k  [0402L]  (hidden comment: CRCW040210K0FKED)
R16  ValueDisplayed: 10.0k  [0402L]  (hidden comment: CRCW040210K0FKED)
R37  4.75K  [RESC1005X40USR]
R38  4.75K  [RESC1005X40USR]
R39  4.75K  [RESC1005X40USR]
R46  4.75K  [RESC1005X40USR]
R47  4.75K  [RESC1005X40USR]
R57  4.75K  [RESC1005X40USR]
R91  ValueDisplayed: 10.0k  [0402L]  (hidden comment: CRCW040210K0FKED)
R170  ValueDisplayed: 2.94k  [0402]  (hidden comment: CRCW04022K94FKED)
R171  ValueDisplayed: 2.94k  [0402]  (hidden comment: CRCW04022K94FKED)
R196  ValueDisplayed: 10.0k  [0402L]  (hidden comment: CRCW040210K0FKED)
R197  ValueDisplayed: 0  [0201]  (hidden comment: CRCW02010000Z0ED)
R198  ValueDisplayed: 0  [0201]  (hidden comment: CRCW02010000Z0ED)
T11  TP_S  [TP_SM_1MM]  (value not drawn)  (no BOM)
T12  TP_S  [TP_SM_1MM]  (value not drawn)  (no BOM)
T13  TP_S  [TP_SM_1MM]  (value not drawn)  (no BOM)
T14  TP_S  [TP_SM_1MM]  (value not drawn)  (no BOM)
T30  TP_S  [TP_SM_1MM]  (value not drawn)  (no BOM)
T34  TP_S  [TP_SM_1MM]  (value not drawn)  (no BOM)
U2  PartNumber: AWR2243ABGABLRQ1  [ABL0161A]  (hidden comment: AWR2243APBGABLQ1)  (parts A,B of 2)
Y1  CX3225SA40000D0PTWCC  [Kyocera_CX3225SA]  (value not drawn)

### Ports
AR_GPIO_2 (out), AR_I2C (harness I2C), AR_MIPI (harness AR_MIPI), AR_NERR_OUT, AR_NRST (in), AR_PMIC_CLKOUT_SOP2 (out), AR_SPI (harness SPI), AR_SYNC_IN (in), AR_SYNC_OUT_SOP1 (out), AR_WARMRST

### Harnesses
SPI: nINTR, CLK, nCS, MISO, MOSI

### Nets
+3.3VD: R14.2 R15.2 R16.2 R37.2 R46.2 R47.2 R57.2 R91.2 R170.2 R171.2 U2.R13(VIOIN)
AR_1P3_RF1: U2.G5(VIN_13RF1) U2.H5(VIN_13RF1) U2.J5(VIN_13RF1)
AR_1P3_RF2: U2.C2(VIN_13RF2) U2.D2(VIN_13RF2)
AR_1V2: U2.F13(VDDIN) U2.N11(VDDIN) U2.P14(VNWA) U2.P15(VDDIN) U2.R6(VDDIN) U2.R14(VIN_SRAM)
AR_1V4_APLL: U2.A10(VOUT_14APLL1)
AR_1V4_SYNTH: U2.A13(VOUT_14SYNTH)
AR_1V8: U2.B11(VIN_18CLK) U2.B12(VIN_18VCO) U2.D13(VIOIN_18DIFF) U2.F5(VIN_18BB) U2.K5(VIN_18BB) U2.K13(VIOIN_18)
AR_VBGAP: U2.B10(VBGAP)
AR_VOUT_PA: U2.A2(VOUT_PA) U2.B2(VOUT_PA)
GND: C8.2 C9.2 C15.1 J11.2 J11.8 R13.1 R38.1 R39.1 R196.1 U2.A1(VSSA) U2.A3(VSSA) U2.A5(VSSA) U2.A7(VSSA) U2.A9(VSSA) U2.A15(VSSA) U2.B1(FM_CW_SYNCIN1) U2.B3(VSSA) U2.B5(VSSA) U2.B7(VSSA) U2.B9(VSSA) U2.B13(VSSA) U2.B14(VSSA) U2.C1(VSSA) U2.C3(VSSA) U2.C4(VSSA) U2.C5(VSSA) U2.C6(VSSA) U2.C7(VSSA) U2.C8(VSSA) U2.C9(VSSA) U2.C15(VSSA) U2.D15(FM_CW_SYNCIN2) U2.E1(VSSA) U2.E2(VSSA) U2.E3(VSSA) U2.E5(VSS) U2.E6(VSS) U2.E8(VSS) U2.E10(VSS) U2.E11(VSS) U2.E13(VSSA) U2.E15(VSSA) U2.F3(VSSA) U2.F9(VSS) U2.F11(VSS) U2.G1(VSSA) U2.G2(VSSA) U2.G3(VSSA) U2.G6(VSS) U2.G7(VSS) U2.G8(VSS) U2.G10(VSS) U2.H3(VSSA) U2.H7(VSS) U2.H9(VSS) U2.H11(VSS) U2.J1(VSSA) U2.J2(VSSA) U2.J3(VSSA) U2.J6(VSS) U2.J7(VSS) U2.J8(VSS) U2.J10(VSS) U2.K3(VSSA) U2.K7(VSS) U2.K8(VSS) U2.K9(VSS) U2.K10(VSS) U2.K11(VSS) U2.L1(VSSA) U2.L2(VSSA) U2.L3(VSSA) U2.L5(VSS) U2.L6(VSS) U2.L8(VSS) U2.L10(VSS) U2.M3(VSSA) U2.N1(VSSA) U2.N2(VSSA) U2.N3(VSSA) U2.R1(VSSA) U2.R15(VSS) Y1.2(GND) Y1.4(GND)
AR_GPIO_2: U2.N13(GPIO[2]) ; port AR_GPIO_2
AR_I2C.SCL: R171.1 R197.1
AR_I2C.SDA: R170.1 R198.1
AR_MIPI.CLK_N: U2.G14(CSI2_TXM[0])
AR_MIPI.CLK_P: U2.G15(CSI2_TXP[0])
AR_MIPI.CSI0_N: U2.H14(CSI2_TXM[1])
AR_MIPI.CSI0_P: U2.H15(CSI2_TXP[1])
AR_MIPI.CSI1_N: U2.J14(CSI2_CLKM)
AR_MIPI.CSI1_P: U2.J15(CSI2_CLKP)
AR_MIPI.CSI2_N: U2.K14(CSI2_TXM[2])
AR_MIPI.CSI2_P: U2.K15(CSI2_TXP[2])
AR_MIPI.CSI3_N: U2.L14(CSI2_TXM[3])
AR_MIPI.CSI3_P: U2.L15(CSI2_TXP[3])
AR_NERR_OUT: R91.1 U2.N8(NERROR_OUT) ; port AR_NERR_OUT
AR_NERRIN: R16.1 T30.1 U2.P7(NERROR_IN)
AR_NRST: J11.1 U2.P12(~{RESET}) ; port AR_NRST
AR_OSC_CLKOUT: T34.1 U2.A14(OSC_CLKOUT)
AR_PMIC_CLKOUT_SOP2: R39.2 U2.P13(PMIC_CLK_OUT) ; port AR_PMIC_CLKOUT_SOP2
AR_RESERVED: C8.1 U2.G13(RESERVED)
AR_SPI.CLK: J11.4 U2.R9(SPI_CLK_1) ; port AR_SPI.CLK
AR_SPI.MISO: J11.6 U2.P5(MISO_1) ; port AR_SPI.MISO
AR_SPI.MOSI: J11.7 U2.R8(MOSI_1) ; port AR_SPI.MOSI
AR_SPI.nCS: J11.5 R14.1 U2.R7(SPI_CS_1) ; port AR_SPI.nCS
AR_SPI.nINTR: J11.3 R13.2 U2.P6(SPI_HOST_INTR_1) ; port AR_SPI.nINTR
AR_SYNC_IN: R196.2 U2.N10(SYNC_IN) ; port AR_SYNC_IN
AR_SYNC_OUT_SOP1: R38.2 U2.P11(SYNC_OUT) ; port AR_SYNC_OUT_SOP1
AR_TCK: R47.1 T11.1 U2.M13(TCK)
AR_TDI: R57.1 T14.1 U2.H13(TDI)
AR_TDO_SOP0: R37.1 T13.1 U2.J13(TDO)
AR_TMS: R46.1 T12.1 U2.L13(TMS)
AR_WARMRST: R15.1 U2.N12(WARM_RESET) ; port AR_WARMRST
AR_XTALM: C9.1 U2.F14(CLKM) Y1.3
AR_XTALP: C15.2 U2.E14(CLKP) Y1.1
RX1: U2.M2(RX1)
RX2: U2.K2(RX2)
RX3: U2.H2(RX3)
RX4: U2.F2(RX4)
TX1: U2.B4(TX1)
TX2: U2.B6(TX2)
TX3: U2.B8(TX3)
NetR197_2: R197.2 U2.P4(RESERVED)
NetR198_2: R198.2 U2.R3(RESERVED)

Not connected (* = marked no-connect by the designer): U2 B15(FM_CW_CLKOUT)* C13(ANAMUX)* C14(VSENSE)* D1(FM_CW_SYNCOUT)* M14(HS_DEBUG1_M)* M15(HS_DEBUG1_P)* N4(GPIO[0]) N5(RS232_RX)* N6(RS232_TX)* N7(GPIO[1]) N9(MCU_CLK_OUT) N14(HS_DEBUG2_M)* N15(HS_DEBUG2_P)* P1(ANALOGTEST1)* P2(ANALOGTEST2)* P3(ANALOGTEST3)* P8(QSPI_CS) P9(QSPI[1]) P10(QSPI[3]) R2(ANALOGTEST4)* R4(RESERVED)* R5(RESERVED)* R10(QSPI_CLK) R11(QSPI[0]) R12(QSPI[2])

### Buses and harness runs
harness AR_I2C = port AR_I2C
harness AR_MIPI = port AR_MIPI
harness AR_SPI = port AR_SPI

### Layout directives
net class RF: RX1, RX2, RX3, RX4, TX1, TX2, TX3
net class GENERAL: AR_I2C.SCL, AR_I2C.SDA, AR_NERR_OUT, AR_NERRIN, AR_NRST, AR_SYNC_OUT_SOP1, AR_WARMRST
net class AWR_PWR: +3.3VD, AR_1P3_RF1, AR_1P3_RF2, AR_1V2, AR_1V4_APLL, AR_1V4_SYNTH, AR_1V8, AR_VBGAP, AR_VOUT_PA
net class CLK: AR_OSC_CLKOUT, AR_PMIC_CLKOUT_SOP2, AR_XTALM, AR_XTALP

### Notes on the sheet
- DUT REFERENCE
- OUTPUT
- 40MHz Crystal
- Mandatory Pullups/Pulldowns
- AWR JTAG
- This should be SOP mode 1 = SPI
- Title
- Size:
- Date:
- A4
- Number:
- Time:
- Revision:
- Sheet
- of
- File:
- (in symbol CMP-0004694-3) G

### Library data of the parts
C8 = CMP-0078219-1: CAP, CERM, 0.1 µF, 10 V,+/- 10%, X7S, 0201; Manufacturer: TDK; TaMin_C: -55°C; Polarized: N; Green_Lifecycle: NRND; SizeAreaWB_mm2: 2.08; Green_REACh: Passed; U/M: EA; Value: 0.1uF; TaMax_C: 125°C; SizeZ_mm: 0.33; SizeX_mm: 0.6; SizeY_mm: 0.3; Cap_Case: 0201; Value2: 10V; SizeArea_mm2: 0.18; Cap_F: 100nF; AEC Category: Q200; ComponentLink1URL: https://product.tdk.com/info/en/catalog/datasheets/mlcc_commercial_general_en.pdf; Supplier Part Number 2: 94Y9906; Supplier 2: Newark; Supplier Part Number 3: 810-C0603X7S1A104K; TempCo: X7S; Supplier 3: Mouser; RoHS: Y; MountType: SMT; Green_EU RoHS-2: Passed; Supplier 1: Digi-Key; Green_EU RoHS: Passed; PackageReference: 0201; Tolerance_%: 10%; CompType: Capacitor; PartNumber: C0603X7S1A104K030BC; AEC Qualified: N; VDC_V: 10V; ComponentLink1Description: Datasheet link; AEC Grade: N/A; Supplier Part Number 1: 445-9051-1-ND; Technology: Ceramic
C9 C15 = CMP-0006367-2: CAP, CERM, 4.7 pF, 50 V, +/- 2%, C0G/NP0, 0402; Manufacturer: MuRata; TaMin_C: -55°C; Polarized: N; SizeAreaWB_mm2: 3; Value1: Unknown; U/M: EA; Value: 4.7pF; TaMax_C: 125°C; SizeZ_mm: 0.6; SizeX_mm: 1; SizeY_mm: 0.5; Value2: 50V; CompType: Capacitor; AEC Category: Q200; Supplier Part Number 2: 81-GJM1555C1H4R7BB01; Publisher: Texas Instruments; Supplier 2: Mouser; TempCo: C0G/NP0; Published: 2008-06-19; RoHS: Y; MountType: SMT; Supplier 1: Digi-Key; PackageReference: 0402; Tolerance_%: 2%; Cap_Case: 0402; SizeArea_mm2: 0.5; LatestRevisionDate: 2017-03-09; PartNumber: GJM1555C1H4R7BB01D; AEC Qualified: N; Cap_F: 4.7pF; VDC_V: 50V; ComponentLink1Description: Datasheet link; AEC Grade: N/A; Supplier Part Number 1: 490-8102-1-ND; Technology: Ceramic; ComponentLink1URL: http://psearch.murata.com/capacitor/product/GJM1555C1H4R7BB01%23.pdf
J11 = Header 8X1: Conn Header Vert 8POS 2.54MM; Manufacturer: Sullins; Manufacturer Part Number: PREC008SAAN-RC; Number of Positions: 8; Connector Type: Male Pin; Pitch: 0.1inch; Supplier 1: Digi-Key; RoHS: Yes; Category: Headers and Wire Housings; Stock 1: 4391; Pricing 1: 1=0.19000, 10=0.17800, 25=0.15200, 50=0.13300, 100=0.12360, 250=0.10928, 500=0.10454 (USD); Mount: Through Hole; Color: Black; Contact Plating: Tin; Package Quantity: 1; Number of Rows: 1; Packaging: Bulk; Termination: Solder; Series: -; Contact Type: Male Pin; Contact Mating Length: 0.23inch; RoHS Compliant: Yes; ComponentLink1URL: https://datasheet.ciiva.com/740/zrzczzzszzn-rc-st-11635-b-740837.pdf?src-supplier=Digi-Key; ComponentLink1Description: https://datasheet.ciiva.com/740/zrzczzzszzn-rc-st-11635-b-740837.pdf?src-supplier=Digi-Key; Supplier Part Number 1: S1012EC-08-ND
R13-R16 R91 = CMP-0025958-3: RES, 10.0 k, 1%, 0.063 W, AEC-Q200 Grade 0, 0402; Manufacturer: Vishay-Dale; Power_W: 63mW; TempCo: 100 ppm/C; Value_Code: 10k0; Value: 10.0k; EIA_Code: E96; Res_ohm: 10k; SizeX_mm: 1; SizeY_mm: 0.5; SizeZ_mm: 0.6; Value2: 0.063W; AEC Qualified: Y; VDC_V: 50V; AEC Category: Q200; AEC Grade: 0; Supplier Part Number 2: 52K6595; Supplier 2: Newark; Supplier Part Number 3: 71-CRCW0402-10K-E3; Supplier 3: Mouser; RoHS: E; Value1: 1%; MountType: SMT; Supplier 1: Digi-Key; PackageReference: 0402; Tolerance_%: 1%; SizeArea_mm2: 0.5; CompType: Resistor; PartNumber: CRCW040210K0FKED; ComponentLink1Description: Datasheet link; Supplier Part Number 1: 541-10.0KLCT-ND; Technology: Thick Film; ComponentLink1URL: http://www.vishay.com/docs/20035/dcrcwe3.pdf
R37-R39 R46 R47 R57 = RES 4.75K OHM 1% 1/16W 0402: Manufacturer: YAGEO; Manufacturer Part Number: RC0402FR-074K75L; Supplier Part Number 1: 311-4.75KLCT-ND; Supplier 1: Digi-Key; Height: 0.4mm; Package: 0402; value: 4.75K
R170 R171 = CMP-0026244-2: RES, 2.94 k, 1%, 0.063 W, AEC-Q200 Grade 0, 0402; Manufacturer: Vishay-Dale; Power_W: 63mW; TempCo: 100 ppm/C; Value_Code: 2k94; Value: 2.94k; EIA_Code: E96; SizeX_mm: 1; SizeY_mm: 0.5; SizeZ_mm: 0.6; Value2: 0.063W; AEC Qualified: Y; VDC_V: 50V; AEC Category: Q200; AEC Grade: 0; ComponentLink1URL: http://www.vishay.com/docs/20035/dcrcwe3.pdf; Supplier Part Number 2: 52K6814; Supplier 2: Newark; Supplier Part Number 3: 71-CRCW0402-2.94K-E3; Supplier 3: Mouser; RoHS: E; Value1: 1%; MountType: SMT; Supplier 1: Digi-Key; PackageReference: 0402; Tolerance_%: 1%; Res_ohm: 2.94k; SizeArea_mm2: 0.5; CompType: Resistor; PartNumber: CRCW04022K94FKED; ComponentLink1Description: Datasheet link; Supplier Part Number 1: 541-2.94KLCT-ND; Technology: Thick Film
R196 = CMP-0025958-3: RES, 10.0 k, 1%, 0.063 W, AEC-Q200 Grade 0, 0402; Manufacturer: Vishay-Dale; Power_W: 63mW; TempCo: 100 ppm/C; Value_Code: 10k0; Value: 10.0k; EIA_Code: E96; Res_ohm: 10k; SizeX_mm: 1; SizeY_mm: 0.5; SizeZ_mm: 0.6; Value2: 0.063W; CompType: Resistor; AEC Qualified: Y; VDC_V: 50V; AEC Category: Q200; AEC Grade: 0; Supplier Part Number 2: 52K6595; Supplier 2: Newark; Supplier Part Number 3: 71-CRCW0402-10K-E3; Supplier 3: Mouser; RoHS: E; Value1: 1%; MountType: SMT; Supplier 1: Digi-Key; PackageReference: 0402; Tolerance_%: 1%; SizeArea_mm2: 0.5; PartNumber: CRCW040210K0FKED; ComponentLink1Description: Datasheet link; Supplier Part Number 1: 541-10.0KLCT-ND; Technology: Thick Film; ComponentLink1URL: http://www.vishay.com/docs/20035/dcrcwe3.pdf
R197 R198 = CMP-0027008-4: RES, 0, 5%, 0.05 W, 0201; Manufacturer: Vishay-Dale; Power_W: 50mW; TempCo: ppm/C; Value_Code: 0000; Value: 0; EIA_Code: E24; SizeX_mm: 0.6; SizeY_mm: 0.3; SizeZ_mm: 0.26; Value2: 0.05W; SizeArea_mm2: 0.18; AEC Qualified: N; AEC Category: Q200; RoHS: E; Value1: 5%; MountType: SMT; Supplier 1: Newark; PackageReference: 0201; Tolerance_%: 5%; Res_ohm: 0; CompType: Resistor; PartNumber: CRCW02010000Z0ED; ComponentLink1Description: Datasheet link; AEC Grade: N/A; Supplier Part Number 1: 72M6743; Technology: Thick Film; ComponentLink1URL: http://www.vishay.com/docs/20052/crcw0201e3.pdf
T11-T14 T30 T34 = Test point PAD: test point
U2 = CMP-0081285-1: Single Chip 77 and 79 GHz FMCW Transceiver, ABL0161A (FCBGA-161); Alternate Manufacturer: Texas Instruments; SizeAreaWB_mm2: 153.76; SizeZ_mm: 1.17; SizeX_mm: 10.4; SizeArea_mm2: 108.16; CompType: IC; AEC Qualified: N; AEC Category: Q200; ComponentLink1URL: http://www.ti.com/lit/ds/symlink/awr1243.pdf; Alternate PartNumber: AWR2243ABGABLRQ1; PackageDescription: FCBGA-161; MountType: SMT; ComponentLink2URL: http://www.ti.com/product/awr1243; ComponentLink3Description: Online Datasheet; ComponentLink2Description: Product Folder; Manufacturer: Texas Instruments; ComponentLink3URL: http://www.ti.com/product/awr1243/datasheet; PackageReference: ABL0161A; SizeY_mm: 10.4; ComponentLink1Description: Datasheet Link; PartId: 1
Y1 = CMP-0004694-3: Crystal, 40 MHz, 8pF, SMD; Manufacturer: Kyocera; TaMin_C: -40°C; Frequency Stability: +/-200ppm; SizeAreaWB_mm2: 14.7; Frequency_Fixed: 40MHz; TaMax_C: 125°C; SizeZ_mm: 0.8; SizeX_mm: 2.5; SizeY_mm: 3.2; SizeArea_mm2: 8; RoHS: Y; MountType: SMT; Supplier 1: Mouser; PackageReference: 3.2x2.5mm; CompType: Crystal; PartNumber: CX3225SA40000D0PTWCC; ComponentLink1Description: Datasheet Link; Supplier Part Number 1: 581-CX3225SA40D0PTWC; ComponentLink1URL: http://www.kyocera-crystal.jp/eng/wp-content/uploads/2016/10/cx3225sa_e.pdf

## Sheet AWR2243_ExPWR_RST_LEDs.SchDoc: =ProjectTitle
size A3; PageSetup: Record=PageOptions|CenterHorizontal=True|CenterVertical=True|PrintScale=1.00|XCorrection=1.00|YCorrection=1.00|PrintKind=0|BorderSize=5000000|LeftOffset=0|BottomOffset=0|Orientation=2|PaperLength=1000|PaperWidth=1000|Scale=100|PaperSource=15|PrintQuality=600|MediaType=1|DitherType=10|PaperKind=Letter|PrintScaleMode=1; Author: Jaime I. Chait; Organization: NWES LLC; Address1: 111 SW 5th Ave, STE 3150; Address2: Portland, OR 97204; DocumentNumber: SCH-0001; Revision: 2; SheetNumber: 7; SheetTotal: 19
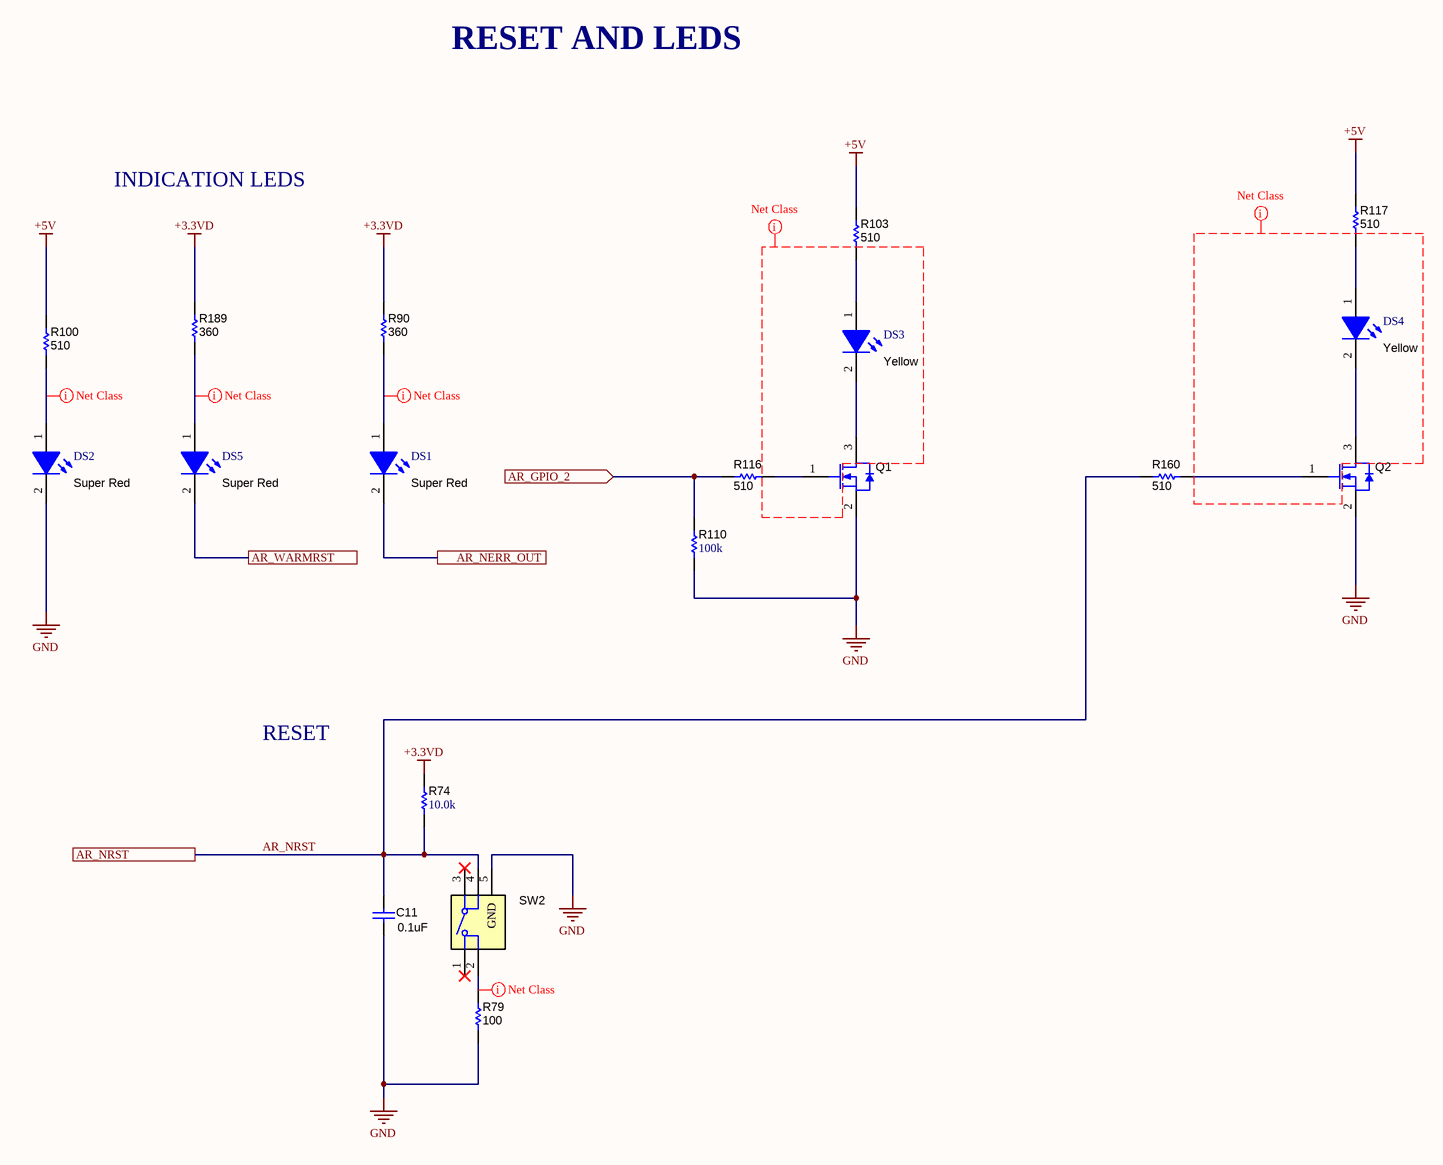
[diagram p4: AWR2243_ExPWR_RST_LEDs.SchDoc]

### Parts
C11  ValueDisplayed: 0.1uF  [0402L]  (hidden comment: GCM155R71C104KA55D)
DS1  value Super Red  [SML-LX0603SRW_SuperRed]  (hidden comment: SML-LX0603SRW-TR)
DS2  value Super Red  [SML-LX0603SRW_SuperRed]  (hidden comment: SML-LX0603SRW-TR)
DS3  value Yellow  [SML-E1_Yellow]  (hidden comment: SML-E12Y8WT86)
DS4  value Yellow  [SML-E1_Yellow]  (hidden comment: SML-E12Y8WT86)
DS5  value Super Red  [SML-LX0603SRW_SuperRed]  (hidden comment: SML-LX0603SRW-TR)
Q1  BSS123  [SOT-23]  (value not drawn)
Q2  BSS123  [SOT-23]  (value not drawn)
R74  ValueDisplayed: 10.0k  [0402L]  (hidden comment: CRCW040210K0FKED)
R79  ValueDisplayed: 100  [0402L]  (hidden comment: ERJ-2GEJ101X)
R90  ValueDisplayed: 360  [0402L]  (hidden comment: ERJ-2GEJ361X)
R100  ValueDisplayed: 510  [0402L]  (hidden comment: ERJ-2GEJ511X)
R103  ValueDisplayed: 510  [0402L]  (hidden comment: ERJ-2GEJ511X)
R110  ValueDisplayed: 100k  [0402L]  (hidden comment: CRCW0402100KFKED)
R116  ValueDisplayed: 510  [0402L]  (hidden comment: ERJ-2GEJ511X)
R117  ValueDisplayed: 510  [0402L]  (hidden comment: ERJ-2GEJ511X)
R160  ValueDisplayed: 510  [0402L]  (hidden comment: ERJ-2GEJ511X)
R189  ValueDisplayed: 360  [0402L]  (hidden comment: ERJ-2GEJ361X)
SW2  KMR243GLFG  [SW_KMR243GLFG]  (value not drawn)

### Ports
AR_GPIO_2 (in), AR_NERR_OUT, AR_NRST, AR_WARMRST

### Nets
+3.3VD: R74.2 R90.2 R189.2
+5V: R100.2 R103.2 R117.2
GND: C11.1 DS2.2(K) Q1.2(S) Q2.2(S) R79.1 R110.1 SW2.5(GND)
AR_GPIO_2: R110.2 R116.1 ; port AR_GPIO_2
AR_NERR_OUT: DS1.2(K) ; port AR_NERR_OUT
AR_NRST: C11.2 R74.1 R160.1 SW2.4 ; port AR_NRST
AR_WARMRST: DS5.2(K) ; port AR_WARMRST
NetDS1_1: DS1.1(A) R90.1
NetDS2_1: DS2.1(A) R100.1
NetDS3_1: DS3.1(A) R103.1
NetDS3_2: DS3.2(K) Q1.3(D)
NetDS4_1: DS4.1(A) R117.1
NetDS4_2: DS4.2(K) Q2.3(D)
NetDS5_1: DS5.1(A) R189.1
NetQ1_1: Q1.1(G) R116.2
NetQ2_1: Q2.1(G) R160.2
NetR79_2: R79.2 SW2.2

Not connected (* = marked no-connect by the designer): SW2 1* 3*

### Layout directives
net class GENERAL: (no net found under the mark), NetDS1_1, NetDS2_1, NetDS5_1, NetR79_2

### Notes on the sheet
- RESET AND LEDS
- INDICATION LEDS
- RESET
- Title
- Size:
- Date:
- A4
- Number:
- Time:
- Revision:
- Sheet
- of
- File:

### Library data of the parts
C11 = CMP-0006351-2: CAP, CERM, 0.1 uF, 16 V, +/- 10%, X7R, 0402; Manufacturer: MuRata; TaMin_C: -55°C; Polarized: N; SizeAreaWB_mm2: 3; Value1: Unknown; U/M: EA; Value: 0.1uF; TaMax_C: 125°C; SizeZ_mm: 0.6; SizeX_mm: 1; SizeY_mm: 0.5; Cap_Case: 0402; Value2: 16V; Cap_F: 100nF; AEC Category: Q200; Publisher: Texas Instruments; TempCo: X7R; Published: 2008-06-19; RoHS: Y; MountType: SMT; Supplier 1: Digi-Key; PackageReference: 0402; Tolerance_%: 10%; SizeArea_mm2: 0.5; CompType: Capacitor; LatestRevisionDate: 2017-03-09; PartNumber: GCM155R71C104KA55D; AEC Qualified: ?; VDC_V: 16V; ComponentLink1Description: Datasheet link; Supplier Part Number 1: 490-4759-2-ND; Technology: Ceramic; ComponentLink1URL: http://psearch.murata.com/capacitor/product/GCM155R71C104KA55%23.pdf
DS1 DS2 DS5 = CMP-0002876-1: LED, Super Red, SMD; Manufacturer: Lumex; Io_A: 20mA; Value1: W; U/M: EA; Vf_V: 1.7V; ComponentLink1URL: http://www.lumex.com/specs/SML-LX0603SRW-TR.pdf; Supplier Part Number 2: 09J9551; Publisher: Texas Instruments; Supplier 2: Newark; Supplier Part Number 3: 696-SML-LX0603SRW; Color: super red; Supplier 3: Mouser; Published: 2008-07-11; RoHS: Y; MountType: SMT; Supplier 1: Digi-Key; PackageReference: LED, 1.6x.6x.8mm; Value2: 1.7V; CompType: LED; Type: ?; LatestRevisionDate: 2017-03-09; PartNumber: SML-LX0603SRW-TR; ComponentLink1Description: Datasheet link; Supplier Part Number 1: 67-1551-1-ND
DS3 DS4 = CMP-0002977-2: LED, Yellow, SMD; Manufacturer: Rohm; Io_A: 20mA; Power_TotalModule: 54mW; Vr_V: 5V; Tjmax_C: 85°C; Value1: 0.054W; U/M: EA; Ir_A: 10µA; Vf_V: 2.2V; LuminousIntensity_IV: 63; Supplier Part Number 2: 755-SML-E12Y8WT86; Publisher: Texas Instruments; Supplier 2: Mouser; Color: yellow; Published: 2008-07-11; RoHS: Y; MountType: SMT; Supplier 1: Digi-Key; PackageReference: 1.6x0.8mm; Value2: 2.2V; CompType: LED; Type: ?; PartNumber: SML-E12Y8WT86; LatestRevisionDate: 2017-03-09; ComponentLink1Description: Datasheet link; Supplier Part Number 1: 511-1588-1-ND; ComponentLink1URL: http://rohmfs.rohm.com/en/products/databook/datasheet/opto/led/chip_mono/sml-e1.pdf
Q1 Q2 = CMP-0000947-2: MOSFET, N-CH, 100 V, 0.17 A, SOT-23; Alternate Manufacturer: None; Manufacturer: Fairchild Semiconductor; SizeZ_mm: 1.1; ChType: N; Value2: 1.8 nC; Value1: 1; VdsMax_V: 100V; SizeX_mm: 2.5; SizeY_mm: 3; Vgs_V: 20V; Value: 100V; Rdson45_ohm: 10; SizeArea_mm2: 7.5; AEC Category: Q101; IdsMax_A: 1.7dA; SizeAreaWB_mm2: 14; U/M: EA; QgTyp_nC: 1.8; Supplier 2: Newark; Supplier 3: Mouser; Supplier 1: Digi-Key; Supplier Part Number 1: BSS123NCT-ND; Supplier Part Number 2: 58K8768; PartNumber: BSS123; ComponentLink1Description: Datasheet link; LatestRevisionDate: 2017-03-09; CompType: MOSFET; PackageReference: SOT-23; LatestRevisionNote: Added parts.; Publisher: Texas Instruments; AEC Qualified: ?; Published: 2008-06-19; Supplier Part Number 3: 512-BSS123; RoHS: Y; MountType: SMT; ComponentLink1URL: http://www.fairchildsemi.com/ds/BS/BSS123.pdf
R74 = CMP-0025958-3: as R13 on sheet AWR2243_DUT; Supplier Part Number 2: 52K6595; Supplier 2: Newark; Supplier Part Number 3: 71-CRCW0402-10K-E3; Supplier 3: Mouser; RoHS: E; Value1: 1%; MountType: SMT; Supplier 1: Digi-Key; PackageReference: 0402; Tolerance_%: 1%; SizeArea_mm2: 0.5; CompType: Resistor; PartNumber: CRCW040210K0FKED; ComponentLink1Description: Datasheet link; Supplier Part Number 1: 541-10.0KLCT-ND; Technology: Thick Film; ComponentLink1URL: http://www.vishay.com/docs/20035/dcrcwe3.pdf
R79 = CMP-0026993-2: RES, 100, 5%, 0.1 W, AEC-Q200 Grade 0, 0402; Manufacturer: Panasonic; Power_W: 100mW; TempCo: 200 ppm/C; Value_Code: 100R; U/M: EA; Value: 100; EIA_Code: E24; SizeX_mm: 1; SizeY_mm: 0.5; SizeZ_mm: 0.6; Value2: 0.1W; AEC Qualified: Y; AEC Grade: 0; AEC Category: Q200; Supplier Part Number 2: 65T8246; Publisher: Texas Instruments; Supplier 2: Newark; Supplier Part Number 3: 2059210; Supplier 3: Farnell; Published: 2008-06-26; RoHS: Y; Value1: 5%; MountType: SMT; Supplier 1: Digi-Key; PackageReference: 0402; Tolerance_%: 5%; Res_ohm: 100; SizeArea_mm2: 0.5; CompType: Resistor; LatestRevisionDate: 2017-03-09; PartNumber: ERJ-2GEJ101X; ComponentLink1Description: Datasheet link; Supplier Part Number 1: P100JCT-ND; Technology: Thick Film; ComponentLink1URL: https://industrial.panasonic.com/cdbs/www-data/pdf/RDA0000/AOA0000C84.pdf
R90 R189 = CMP-0078194-1: RES, 360, 5%, 0.1 W, AEC-Q200 Grade 0, 0402; Manufacturer: Panasonic; Value_Code: 360R; SizeArea_mm2: 0.5; AEC Qualified: Y; AEC Category: Q200; Value: 360; SizeZ_mm: 0.6; EIA_Code: E24; TempCo: 200 ppm/C; AEC Grade: 0; Power_W: 100mW; VDC_V: 50V; Value2: 0.1W; U/M: EA; SizeX_mm: 1; ComponentLink1Description: Datasheet link; RoHS: Y; Supplier Part Number 3: 667-ERJ-2GEJ361X; Tolerance_%: 5%; Supplier 1: Digi-Key; PackageReference: 0402; Technology: Thick Film; Res_ohm: 360; PartNumber: ERJ-2GEJ361X; Supplier Part Number 2: 53W4165; Supplier 2: Newark; SizeY_mm: 0.5; ComponentLink1URL: https://industrial.panasonic.com/cdbs/www-data/pdf/RDA0000/DMA0000COL9.pdf; Value1: 5%; CompType: Resistor; MountType: SMT; Supplier Part Number 1: P360JCT-ND; Supplier 3: Mouser
R100 R103 R116 R117 R160 = CMP-0078212-1: RES, 510, 5%, 0.1 W, AEC-Q200 Grade 0, 0402; Manufacturer: Panasonic; Value_Code: 510R; SizeArea_mm2: 0.5; AEC Qualified: Y; AEC Category: Q200; Value: 510; SizeZ_mm: 0.6; EIA_Code: E24; TempCo: 200 ppm/C; AEC Grade: 0; Power_W: 100mW; VDC_V: 50V; Value2: 0.1W; U/M: EA; SizeX_mm: 1; ComponentLink1Description: Datasheet link; RoHS: Y; Supplier Part Number 3: 667-ERJ-2GEJ511X; Tolerance_%: 5%; Supplier 1: Digi-Key; PackageReference: 0402; Technology: Thick Film; Res_ohm: 510; PartNumber: ERJ-2GEJ511X; Supplier Part Number 2: 65T8293; Supplier 2: Newark; SizeY_mm: 0.5; ComponentLink1URL: https://industrial.panasonic.com/cdbs/www-data/pdf/RDA0000/DMA0000COL9.pdf; Value1: 5%; CompType: Resistor; MountType: SMT; Supplier Part Number 1: P510JCT-ND; Supplier 3: Mouser
R110 = CMP-0025950-3: RES, 100 k, 1%, 0.063 W, AEC-Q200 Grade 0, 0402; Manufacturer: Vishay-Dale; Power_W: 63mW; TempCo: 100 ppm/C; Value: 100k; EIA_Code: E96; SizeX_mm: 1; SizeY_mm: 0.5; SizeZ_mm: 0.6; Value2: 0.063W; AEC Qualified: Y; VDC_V: 50V; AEC Category: Q200; AEC Grade: 0; Supplier Part Number 2: 52K6607; Supplier 2: Newark; Supplier Part Number 3: 71-CRCW0402-100K-E3; Supplier 3: Mouser; Value_Code: 100k; RoHS: E; Value1: 1%; MountType: SMT; Supplier 1: Digi-Key; PackageReference: 0402; Tolerance_%: 1%; Res_ohm: 100k; SizeArea_mm2: 0.5; CompType: Resistor; PartNumber: CRCW0402100KFKED; ComponentLink1Description: Datasheet link; Supplier Part Number 1: 541-100KLCT-ND; Technology: Thick Film; ComponentLink1URL: http://www.vishay.com/docs/20035/dcrcwe3.pdf
SW2 = CMP-0002325-1: Switch, SPST-NO, Off-Mom, 0.01 A, 32 VDC, SMD; Manufacturer: C&K Components; CurrentRating_mA: 10A; PositionCount: 1; SizeX_mm: 4.6; SizeY_mm: 2.8; SizeZ_mm: 1.9; SizeArea_mm2: 12.88; VDC_V: 32V; SizeAreaWB_mm2: 21.28; Supplier 2: Mouser; Supplier 1: Digi-Key; Supplier Part Number 1: 401-1432-2-ND; Supplier Part Number 2: 611-KMR243GLFG; PartNumber: KMR243GLFG; ComponentLink1Description: Datasheet URL; LatestRevisionDate: 2017-03-09; ComponentLink1URL: http://www.ckswitches.com/media/1479/kmr2.pdf; CompType: Switch; Publisher: Texas Instruments; Circuit: SPST-NO; RoHS: Y; Orientation: Top Actuated; SwitchFunction: Off-Mom; PackageReference: 4.2x2.8mm; MountType: SMT

## Sheet AWR2243_LC_Filtering.SchDoc: =ProjectTitle
size A3; PageSetup: Record=PageOptions|CenterHorizontal=True|CenterVertical=True|PrintScale=1.00|XCorrection=1.00|YCorrection=1.00|PrintKind=0|BorderSize=5000000|LeftOffset=0|BottomOffset=0|Orientation=2|PaperLength=1000|PaperWidth=1000|Scale=100|PaperSource=15|PrintQuality=600|MediaType=1|DitherType=10|PaperKind=Letter|PrintScaleMode=1; Author: Jaime I. Chait; Organization: NWES LLC; Address1: 111 SW 5th Ave, STE 3150; Address2: Portland, OR 97204; DocumentNumber: SCH-0001; Revision: 2; SheetNumber: 8; SheetTotal: 19
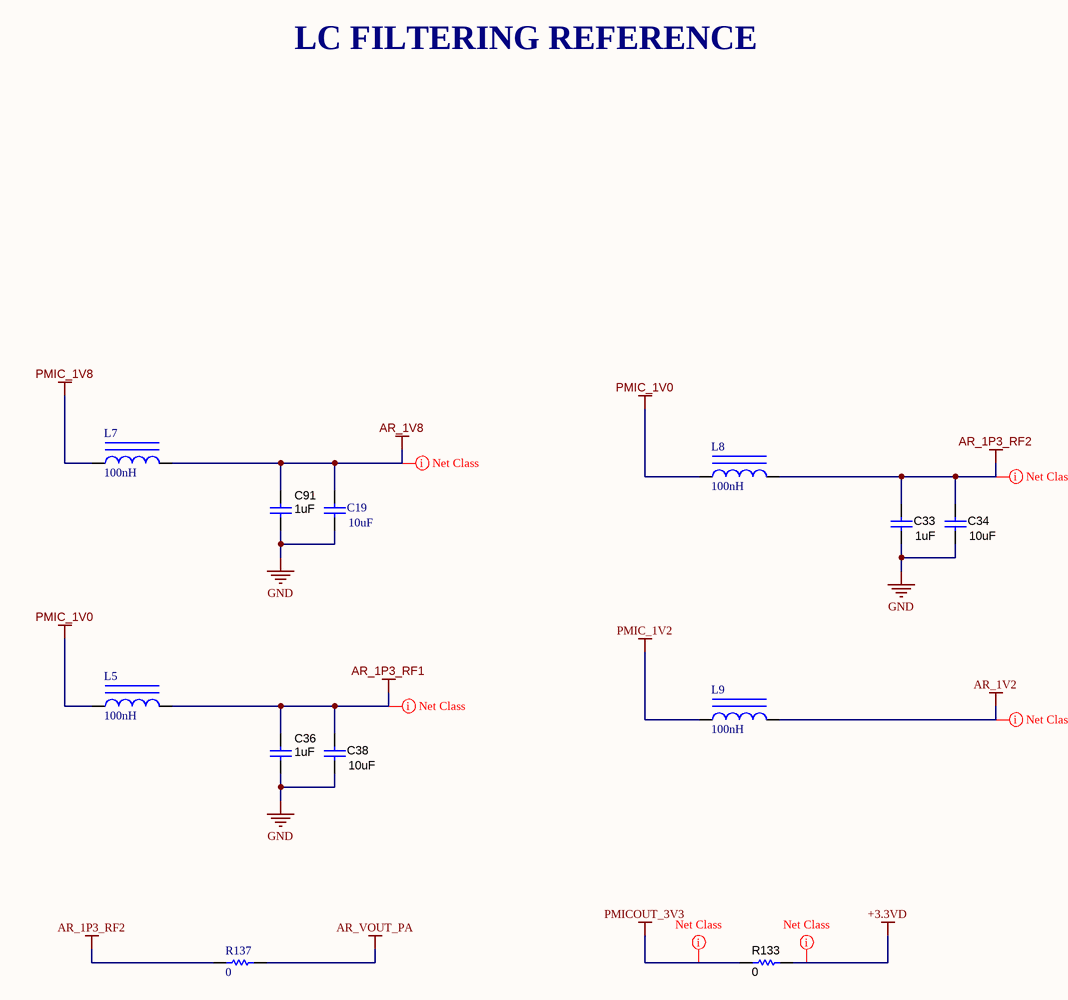
[diagram p5: AWR2243_LC_Filtering.SchDoc]

### Parts
C19  ValueDisplayed: 10uF  [0805_HV]  (hidden comment: GCM21BR71A106KE22L)
C33  ValueDisplayed: 1uF  [0603]  (hidden comment: GCM188R71C105KA64D)
C34  ValueDisplayed: 10uF  [0805_HV]  (hidden comment: GCM21BR71A106KE22L)
C36  ValueDisplayed: 1uF  [0603]  (hidden comment: GCM188R71C105KA64D)
C38  ValueDisplayed: 10uF  [0805_HV]  (hidden comment: GCM21BR71A106KE22L)
C91  ValueDisplayed: 1uF  [0603]  (hidden comment: GCM188R71C105KA64D)
L5  ValueDisplayed: 100nH  [NLCV32]  (hidden comment: NLCV32T-R10M-EFRD)
L7  ValueDisplayed: 100nH  [NLCV32]  (hidden comment: NLCV32T-R10M-EFRD)
L8  ValueDisplayed: 100nH  [NLCV32]  (hidden comment: NLCV32T-R10M-EFRD)
L9  ValueDisplayed: 100nH  [NLCV32]  (hidden comment: NLCV32T-R10M-EFRD)
R133  ValueDisplayed: 0  [0603]  (hidden comment: MCT06030Z0000ZP500)
R137  ValueDisplayed: 0  [0603]  (hidden comment: MCT06030Z0000ZP500)

### Nets
+3.3VD: R133.2
AR_1P3_RF1: C36.2 C38.2 L5.2
AR_1P3_RF2: C33.2 C34.2 L8.2 R137.1
AR_1V2: L9.2
AR_1V8: C19.1 C91.2 L7.2
AR_VOUT_PA: R137.2
GND: C19.2 C33.1 C34.1 C36.1 C38.1 C91.1
PMIC_1V0: L5.1 L8.1
PMIC_1V2: L9.1
PMIC_1V8: L7.1
PMICOUT_3V3: R133.1

### Layout directives
net class PWR: +3.3VD, AR_1P3_RF1, AR_1P3_RF2, AR_1V2, AR_1V8, PMICOUT_3V3

### Notes on the sheet
- LC FILTERING REFERENCE
- Title
- Size:
- Date:
- A4
- Number:
- Time:
- Revision:
- Sheet
- of
- File:

### Library data of the parts
C19 = CMP-0008017-2: as C17 on sheet AWR2243_Decoupling_Caps; Supplier Part Number 2: 06AC6014; Publisher: Texas Instruments; Supplier 2: Newark; Supplier Part Number 3: 81-GCM21BR71A106KE2L; TempCo: X7R; Supplier 3: Mouser; Published: 2008-06-19; RoHS: Y; MountType: SMT; Supplier 1: Digi-Key; PackageReference: 0805; Tolerance_%: 10%; CompType: Capacitor; LatestRevisionDate: 2017-03-09; PartNumber: GCM21BR71A106KE22L; AEC Qualified: ?; VDC_V: 10V; ComponentLink1Description: Datasheet link; Supplier Part Number 1: 490-10674-1-ND; Technology: Ceramic; ComponentLink1URL: http://www.murata.com/products/catalog/pdf/c03e.pdf
C33 C36 C91 = CMP-0007136-5: as C13 on sheet AWR2243_Decoupling_Caps; Supplier Part Number 2: 81-GCM188R71C105K64D; Publisher: Texas Instruments; Supplier 2: Mouser; TempCo: X7R; Published: 2008-06-19; RoHS: Y; MountType: SMT; Supplier 1: Digi-Key; PackageReference: 0603; Tolerance_%: 10%; Cap_Case: 0603; CompType: Capacitor; LatestRevisionDate: 2017-03-09; PartNumber: GCM188R71C105KA64D; VDC_V: 16V; ComponentLink1Description: Datasheet link; AEC Grade: 1; Supplier Part Number 1: 490-5241-6-ND; Technology: Ceramic; ComponentLink1URL: http://psearch.en.murata.com/capacitor/product/GCM188R71C105KA64%23.pdf
C34 C38 = CMP-0008017-2: as C45 on sheet AWR2243_Decoupling_Caps; Supplier Part Number 2: 06AC6014; Publisher: Texas Instruments; Supplier 2: Newark; Supplier Part Number 3: 81-GCM21BR71A106KE2L; TempCo: X7R; Supplier 3: Mouser; Published: 2008-06-19; RoHS: Y; MountType: SMT; Supplier 1: Digi-Key; PackageReference: 0805; Tolerance_%: 10%; LatestRevisionDate: 2017-03-09; PartNumber: GCM21BR71A106KE22L; AEC Qualified: ?; VDC_V: 10V; ComponentLink1Description: Datasheet link; Supplier Part Number 1: 490-10674-1-ND; Technology: Ceramic; ComponentLink1URL: http://www.murata.com/products/catalog/pdf/c03e.pdf
L5 L7-L9 = CMP-0083745-1: Inductor, Wirewound, Ferrite, 100 nH, 2.85 A, 0.024 ohm, AEC-Q200 Grade 1, SMD; Manufacturer: TDK; Isat: 2.85A @ 10% inductance drop; Irms: 2.85A @ 40C rise; SizeAreaWB_mm2: 13.44; DCR_ohm: 0.024; Value: 100nH; Imax_A: 2.85A; SizeZ_mm: 2.5; SizeX_mm: 3.2; SizeY_mm: 2.2; SizeArea_mm2: 7.04; AEC Qualified: Y; AEC Grade: 1; AEC Category: Q200; ComponentLink1URL: https://product.tdk.com/info/en/catalog/datasheets/inductor_automotive_decoupling_nlcv32-efrd_en.pdf; RoHS: Y; Value1: 0.024 ohm; Material: Ferrite; MountType: SMT; PackageReference: 3.2x2.2x2.5mm; Value2: 2.85A; CompType: Inductor; Ind_H: 100nH; PartNumber: NLCV32T-R10M-EFRD; ComponentLink1Description: Datasheet link; Technology: Wirewound
R133 = CMP-0025884-3: RES, 0, 5%, 0.125 W, 0603; Manufacturer: Vishay/Beyschlag; Power_W: 125mW; TempCo: ppm/C; Value_Code: 0000; U/M: EA; Value: 0; EIA_Code: E24; SizeX_mm: 1.6; SizeY_mm: 0.8; SizeZ_mm: 1; Value2: 0.125W; SizeArea_mm2: 1.28; AEC Qualified: N; AEC Category: Q200; Supplier Part Number 2: 96Y9454; Publisher: Texas Instruments; Supplier 2: Newark; Supplier Part Number 3: 594-MCT06030Z0000ZP5; Supplier 3: Mouser; Published: 2008-06-26; RoHS: Y; Value1: 5%; MountType: SMT; Supplier 1: Digi-Key; PackageReference: 0603; Tolerance_%: 5%; Res_ohm: 0; CompType: Resistor; LatestRevisionDate: 2017-03-09; PartNumber: MCT06030Z0000ZP500; ComponentLink1Description: Datasheet link; AEC Grade: N/A; Supplier Part Number 1: MCT0603-0.0-ZZCT-ND; Technology: Thin Film; ComponentLink1URL: http://www.vishay.com/docs/28705/mcx0x0xpro.pdf
R137 = CMP-0025884-3: RES, 0, 5%, 0.125 W, 0603; Manufacturer: Vishay/Beyschlag; Power_W: 125mW; TempCo: ppm/C; Value_Code: 0000; U/M: EA; Value: 0; EIA_Code: E24; SizeX_mm: 1.6; SizeY_mm: 0.8; SizeZ_mm: 1; Value2: 0.125W; SizeArea_mm2: 1.28; CompType: Resistor; AEC Qualified: N; AEC Category: Q200; Supplier Part Number 2: 96Y9454; Publisher: Texas Instruments; Supplier 2: Newark; Supplier Part Number 3: 594-MCT06030Z0000ZP5; Supplier 3: Mouser; Published: 2008-06-26; RoHS: Y; Value1: 5%; MountType: SMT; Supplier 1: Digi-Key; PackageReference: 0603; Tolerance_%: 5%; Res_ohm: 0; LatestRevisionDate: 2017-03-09; PartNumber: MCT06030Z0000ZP500; ComponentLink1Description: Datasheet link; AEC Grade: N/A; Supplier Part Number 1: MCT0603-0.0-ZZCT-ND; Technology: Thin Film; ComponentLink1URL: http://www.vishay.com/docs/28705/mcx0x0xpro.pdf